# EAGLE design farduino_pico (EAGLE 7.7.0)
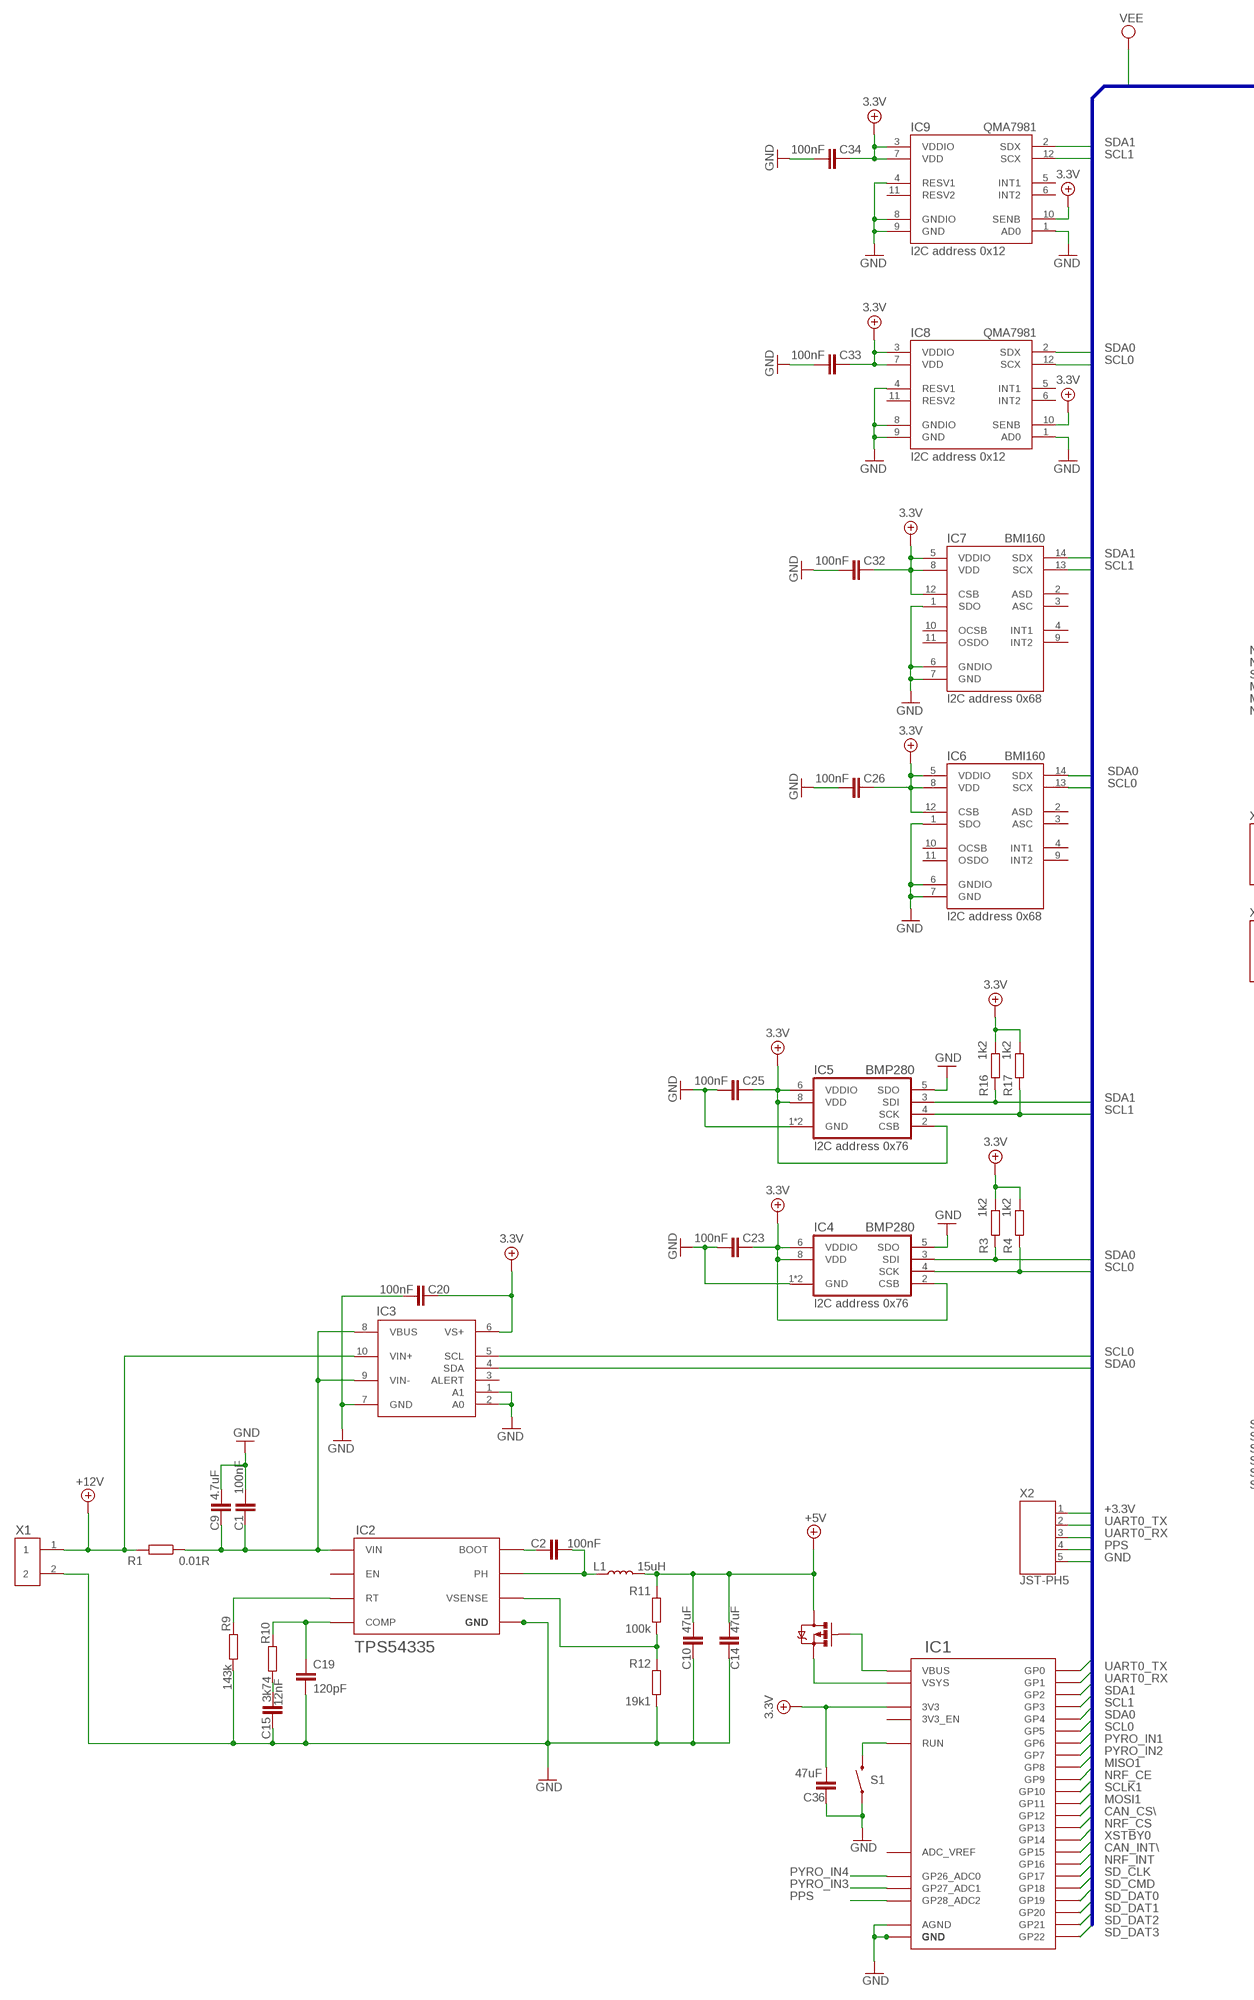
[diagram p0: schematic, sheet 1, part 1 of 2]
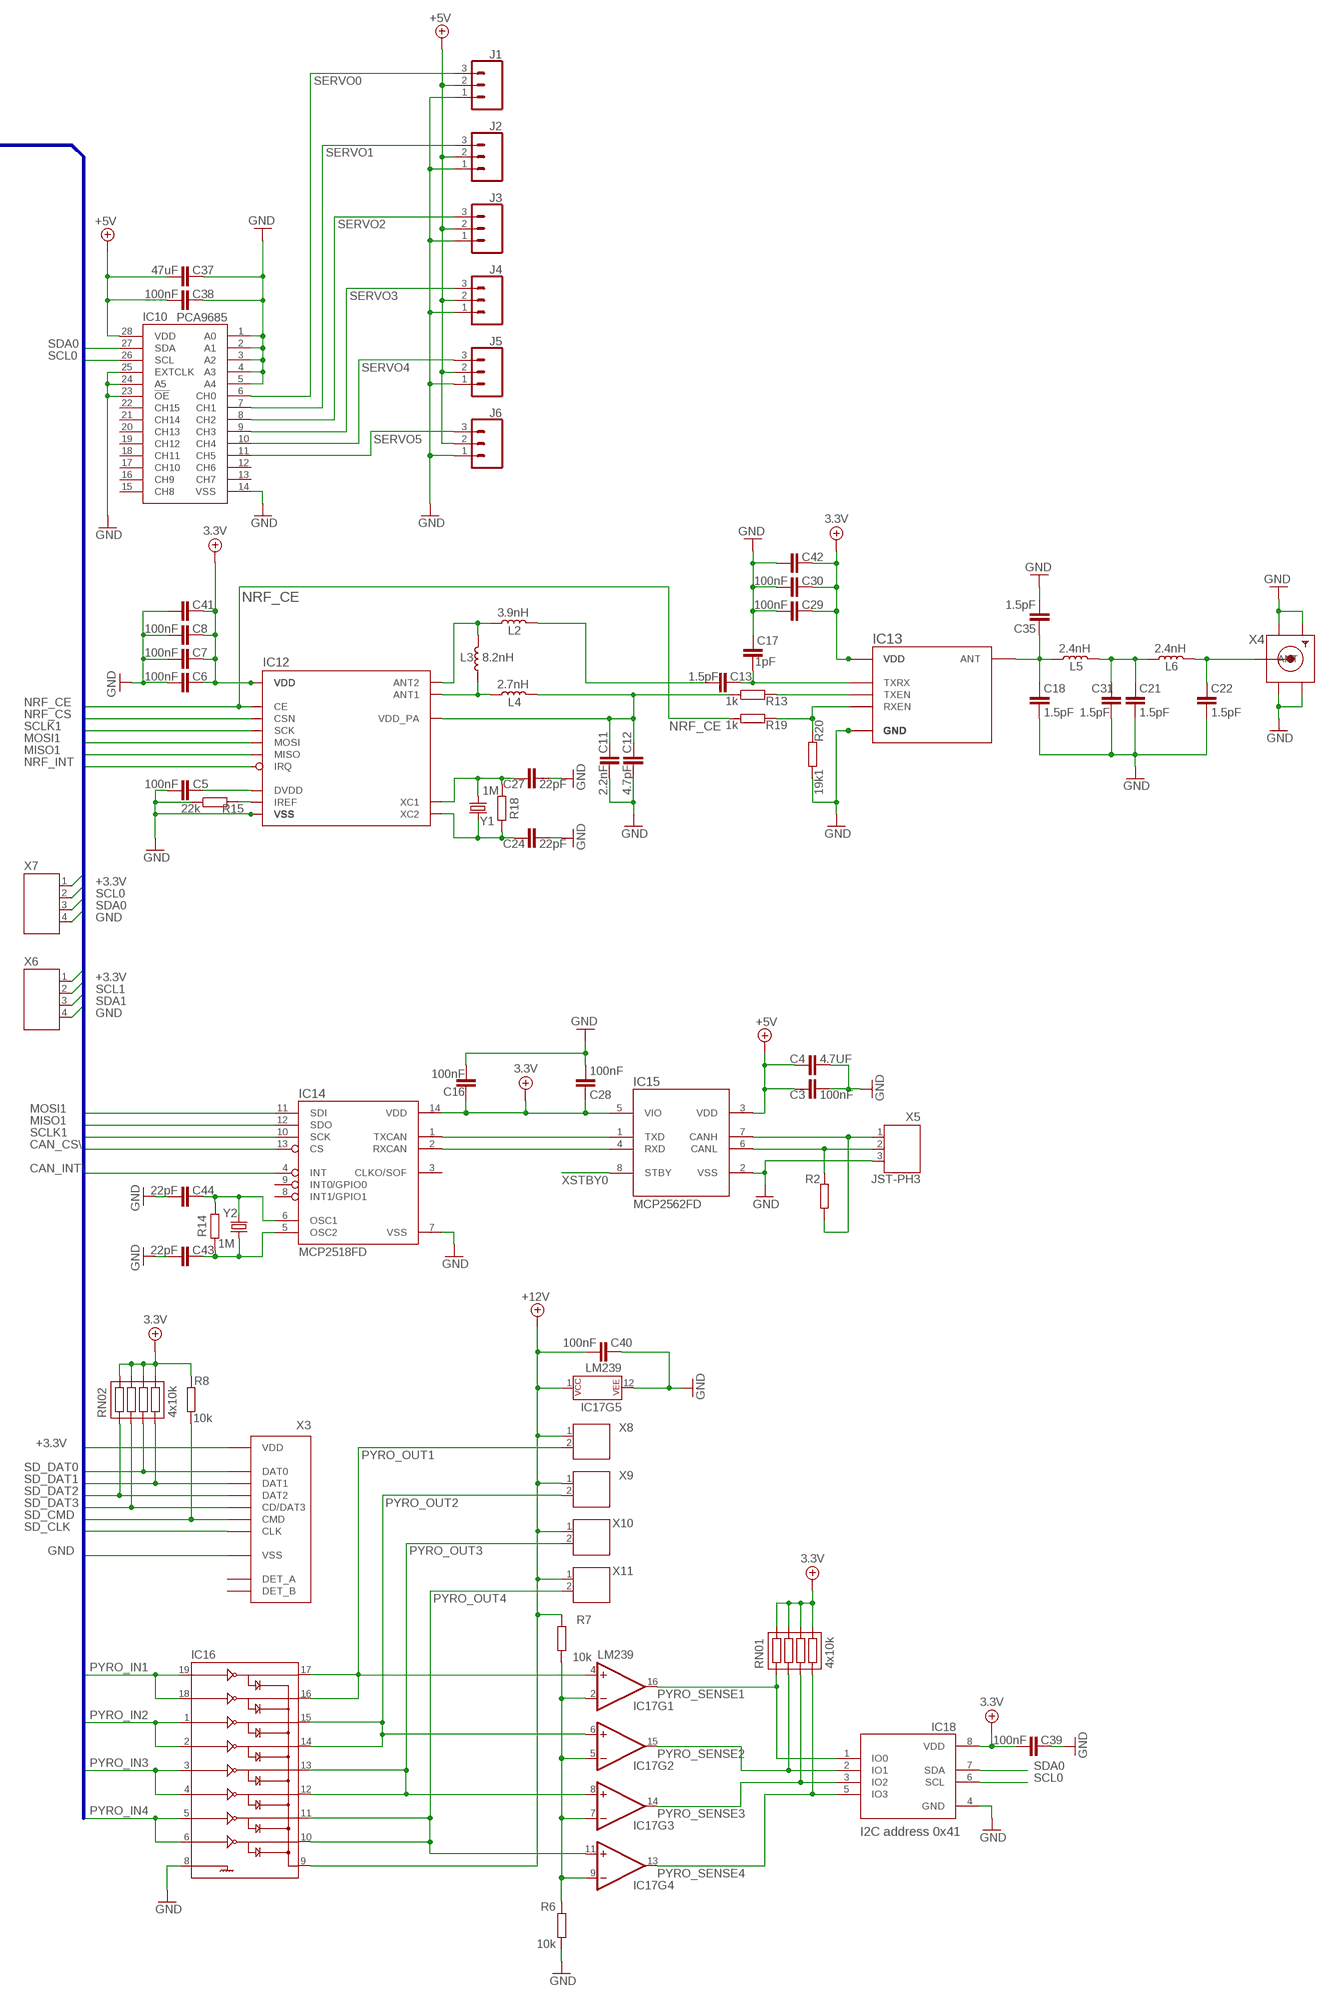
[diagram p1: schematic, sheet 1, part 2 of 2]

## Parts
C1  100nF  0.1UF-0402-16V-10%  [0402]
C2  100nF  0.1UF-0402-16V-10%  [0402]
C3  100nF  0.1UF-0402-16V-10%  [0402]
C4  4.7UF  [0402]
C5  100nF  0.1UF-0402-16V-10%  [0402]
C6  100nF  0.1UF-0402-16V-10%  [0402]
C7  100nF  0.1UF-0402-16V-10%  [0402]
C8  100nF  0.1UF-0402-16V-10%  [0402]
C9  4.7uF  4.7UF-1206-16V-(+80/-20%)  [1206]
C10  47uF  47UF-1206-10V-20%  [1206]
C11  2.2nF  C-EUC0402  [C0402]
C12  4.7pF  C-EUC0402  [C0402]
C13  1.5pF  C-EUC0402  [C0402]
C14  47uF  47UF-1206-10V-20%  [1206]
C15  12nF  C-EUC0402  [C0402]
C16  100nF  0.1UF-0402-16V-10%  [0402]
C17  1pF  C-EUC0402  [C0402]
C18  1.5pF  C-EUC0402  [C0402]
C19  120pF  C-EUC0402  [C0402]
C20  100nF  0.1UF-0402-16V-10%  [0402]
C21  1.5pF  C-EUC0402  [C0402]
C22  1.5pF  C-EUC0402  [C0402]
C23  100nF  0.1UF-0402-16V-10%  [0402]
C24  22pF  C-EUC0402  [C0402]
C25  100nF  0.1UF-0402-16V-10%  [0402]
C26  100nF  0.1UF-0402-16V-10%  [0402]
C27  22pF  C-EUC0402  [C0402]
C28  100nF  0.1UF-0402-16V-10%  [0402]
C29  100nF  0.1UF-0402-16V-10%  [0402]
C30  100nF  0.1UF-0402-16V-10%  [0402]
C31  1.5pF  C-EUC0402  [C0402]
C32  100nF  0.1UF-0402-16V-10%  [0402]
C33  100nF  0.1UF-0402-16V-10%  [0402]
C34  100nF  0.1UF-0402-16V-10%  [0402]
C35  1.5pF  C-EUC0402  [C0402]
C36  47uF  47UF-1206-10V-20%  [1206]
C37  47uF  47UF-1206-10V-20%  [1206]
C38  100nF  0.1UF-0402-16V-10%  [0402]
C39  100nF  0.1UF-0402-16V-10%  [0402]
C40  100nF  0.1UF-0402-16V-10%  [0402]
C41  4.7UF  [0402]
C42  4.7UF  [0402]
C43  22pF  C-EUC0402  [C0402]
C44  22pF  C-EUC0402  [C0402]
IC1  RPI_PICO-SMD  [RPI_PICO]
IC2  TPS54335ADRCR  [VSON-10]
IC3  INA226  [VSSOP-10]
IC4  BMP280  [BMP280]
IC5  BMP280  [BMP280]
IC6  BMI160  [BMI160]
IC7  BMI160  [BMI160]
IC8  QMA7981  [LGA-12-2X2]
IC9  QMA7981  [LGA-12-2X2]
IC10  PCA9685  [TSSOP-28_4MM]
IC12  NRF24L01SMD  [QFN20-4X4MM]
IC13  RFX2401C  [QFN-16-3X3MM]
IC14  MCP2518FD  [SO14]
IC15  MCP2562FD  MCP2562  [SO08]
IC16  ULN2803QFN  [QFN-20-4X4]
IC17  LM239  LM339QT  [QFN16]
IC18  PCA9536  [HVSON8]
J1  CONN_03  [1X03]
J2  CONN_03  [1X03]
J3  CONN_03  [1X03]
J4  CONN_03  [1X03]
J5  CONN_03  [1X03]
J6  CONN_03  [1X03]
L1  15uH  INDUCTOR-YSPIA0850-15UH  [YSPIA0850]
L2  3.9nH  INDUCTOR-0402-3.9NH  [0402]
L3  8.2nH  INDUCTOR-0402-3.9NH  [0402]
L4  2.7nH  INDUCTOR-0402-3.9NH  [0402]
L5  2.4nH  INDUCTOR-0402-3.9NH  [0402]
L6  2.4nH  INDUCTOR-0402-3.9NH  [0402]
Q1  DMG2305UX  MOSFET-PCHANNEL  [SOT23-3@1]
R1  0.01R  R-EU_R1206  [R1206]
R2  120  R-EU_R0402  [R0402]
R3  1k2  R-EU_R0402  [R0402]
R4  1k2  R-EU_R0402  [R0402]
R6  10k  R-EU_R0402  [R0402]
R7  10k  R-EU_R0402  [R0402]
R8  10k  R-EU_R0402  [R0402]
R9  143k  R-EU_R0402  [R0402]
R10  3k74  R-EU_R0402  [R0402]
R11  100k  R-EU_R0402  [R0402]
R12  19k1  R-EU_R0402  [R0402]
R13  1k  R-EU_R0402  [R0402]
R14  1M  R-EU_R0402  [R0402]
R15  22k  R-EU_R0402  [R0402]
R16  1k2  R-EU_R0402  [R0402]
R17  1k2  R-EU_R0402  [R0402]
R18  1M  R-EU_R0402  [R0402]
R19  1k  R-EU_R0402  [R0402]
R20  19k1  R-EU_R0402  [R0402]
RN01  4x10k  RN_EU  [4D02]
RN02  4x10k  RN_EU  [4D02]
S1  MOMENTARY-SWITCH-SPST  [TACTILE_SWITCH_SMD_4.2X3.2MM]
X1  XT_CONN  [XT30_PCB]
X2  JST-PH5  [JST-PH5]
X3  5033981892  [5033981892]
X4  SMACONNECTOR  [SMA90_DIP]
X5  JST-PH3  [JST-PH3]
X6  JST-PH4  [JST-PH4]
X7  JST-PH4  [JST-PH4]
X8  JST-PH2  [JST-PH2]
X9  JST-PH2  [JST-PH2]
X10  JST-PH2  [JST-PH2]
X11  JST-PH2  [JST-PH2]
Y1  CRYSTAL-16MHZ  [SMD3225]
Y2  CRYSTAL-16MHZ  [SMD3225]

## Nets
+3.3V: C6.1 C7.1 C8.1 C16.1 C20.2 C23.1 C25.1 C26.1 C28.1 C29.1 C30.1 C32.1 C33.1 C34.1 C36.2 C39.2 C41.2 C42.2 IC1.3V3 IC3.6(VS+) IC4.2(CSB) IC4.6(VDDIO) IC4.8(VDD) IC5.2(CSB) IC5.6(VDDIO) IC5.8(VDD) IC6.5(VDDIO) IC6.8(VDD) IC6.12(CSB) IC7.5(VDDIO) IC7.8(VDD) IC7.12(CSB) IC8.3(VDDIO) IC8.7(VDD) IC8.10(SENB) IC9.3(VDDIO) IC9.7(VDD) IC9.10(SENB) IC12.7(VDD) IC12.15(VDD) IC12.18(VDD) IC13.14(VDD) IC13.16(VDD) IC14.14(VDD) IC15.5(VIO) IC18.8(VDD) R3.2 R4.2 R8.2 R16.2 R17.2 RN01.5 RN01.6 RN01.7 RN01.8 RN02.5 RN02.6 RN02.7 RN02.8 X2.1 X3.4(VDD) X6.1 X7.1 ; supply symbol labelled 3.3V
+5V: C3.1 C4.1 C10.2 C14.2 C37.2 C38.2 IC10.28(VDD) IC15.3(VDD) J1.2 J2.2 J3.2 J4.2 J5.2 J6.2 L1.2 Q1.3(D) R11.2
+12V: C40.2 IC3.10(VIN+) IC16.9(COM) IC17.1(P$V+) R1.2 R7.2 X1.1 X8.1 X9.1 X10.1 X11.1
ANT1: IC12.12(ANT1) L3.1 L4.1
ANT2: IC12.13(ANT2) L2.1 L3.2
CAN1_H: IC15.7(CANH) R2.1 X5.1
CAN1_L: IC15.6(CANL) R2.2 X5.2
CAN_CS\: IC1.GP12 IC14.13(CS)
CAN_INT\: IC1.GP15 IC14.4(INT)
DCDC_BOOT: C2.2 IC2.9(BOOT)
DCDC_COMP: C19.1 IC2.7(COMP) R10.1
DCDC_PH: C2.1 IC2.2(PH) L1.1
DCDC_RT: IC2.10(RT) R9.1
DVDD: C5.1 IC12.19(DVDD)
FILTER1: C21.1 C31.1 L5.2 L6.1
GND: C1.1 C3.2 C4.2 C5.2 C6.2 C7.2 C8.2 C9.2 C10.1 C11.2 C12.2 C14.1 C15.2 C16.2 C17.1 C18.2 C19.2 C20.1 C21.2 C22.2 C23.2 C24.2 C25.2 C26.2 C27.2 C28.2 C29.2 C30.2 C31.2 C32.2 C33.2 C34.2 C35.2 C36.1 C37.1 C38.1 C39.1 C40.1 C41.1 C42.1 C43.2 C44.2 IC1.AGND IC1.GND@1(GND) IC1.GND@2(GND) IC1.GND@3(GND) IC1.GND@4(GND) IC1.GND@5(GND) IC1.GND@6(GND) IC1.GND@7(GND) IC1.GND@8(GND) IC2.3(GND) IC2.4(GND) IC2.5(GND) IC2.11(GND) IC3.1(A1) IC3.2(A0) IC3.7(GND) IC4.1(GND) IC4.5(SDO) IC4.7(GND) IC5.1(GND) IC5.5(SDO) IC5.7(GND) IC6.1(SDO) IC6.6(GNDIO) IC6.7(GND) IC7.1(SDO) IC7.6(GNDIO) IC7.7(GND) IC8.1(AD0) IC8.4(RESV1) IC8.8(GNDIO) IC8.9(GND) IC9.1(AD0) IC9.4(RESV1) IC9.8(GNDIO) IC9.9(GND) IC10.1(A0) IC10.2(A1) IC10.3(A2) IC10.4(A3) IC10.5(A4) IC10.14(VSS) IC10.23(!OE) IC10.24(A5) IC10.25(EXTCLK) IC12.0(VSS) IC12.8(VSS) IC12.14(VSS) IC12.17(VSS) IC12.20(VSS) IC13.1(GND) IC13.2(GND) IC13.3(GND) IC13.7(GND) IC13.8(GND) IC13.9(GND) IC13.11(GND) IC13.12(GND) IC13.15(GND) IC13.17(GND) IC14.7(VSS) IC15.2(VSS) IC16.8(GND) IC17.12(P$V-) IC18.4(GND) J1.1 J2.1 J3.1 J4.1 J5.1 J6.1 R6.1 R9.2 R12.1 R15.1 R20.1 S1.1 S1.2 X1.2 X2.5 X3.6(VSS) X4.GND1 X4.GND2 X4.GND3 X4.GND4 X5.3 X6.4 X7.4
IREF: IC12.16(IREF) R15.2
MISO1: IC1.GP8 IC12.5(MISO) IC14.12(SDO)
MOSI1: IC1.GP11 IC12.4(MOSI) IC14.11(SDI)
N$6: C15.1 R10.2
NRF_CE: IC1.GP9 IC12.1(CE) R19.1
NRF_CS: IC1.GP13 IC12.2(CSN)
NRF_INT: IC1.GP16 IC12.6(IRQ)
NRF_SIGNAL: C13.2 L2.2
OSC1_40MHZ: C44.1 IC14.6(OSC1) R14.2 Y2.3
OSC2_40MHZ: C43.1 IC14.5(OSC2) R14.1 Y2.1
PA_ANT: C18.1 C35.1 IC13.10(ANT) L5.1
PPS: IC1.GP28_A2(GP28_ADC2) X2.4
PYRO_IN1: IC1.GP6 IC16.18(IN2) IC16.19(IN1)
PYRO_IN2: IC1.GP7 IC16.1(IN3) IC16.2(IN4)
PYRO_IN3: IC1.GP27_A1(GP27_ADC1) IC16.3(IN5) IC16.4(IN6)
PYRO_IN4: IC1.GP26_A0(GP26_ADC0) IC16.5(IN7) IC16.6(IN8)
PYRO_OUT1: IC16.16(OUT2) IC16.17(OUT1) IC17.4(+IN) X8.2
PYRO_OUT2: IC16.14(OUT4) IC16.15(OUT3) IC17.6(+IN) X9.2
PYRO_OUT3: IC16.12(OUT6) IC16.13(OUT5) IC17.8(+IN) X10.2
PYRO_OUT4: IC16.10(OUT8) IC16.11(OUT7) IC17.11(+IN) X11.2
PYRO_SENSE1: IC17.16(OUT) IC18.1(IO0) RN01.1
PYRO_SENSE2: IC17.15(OUT) IC18.2(IO1) RN01.2
PYRO_SENSE3: IC17.14(OUT) IC18.3(IO2) RN01.3
PYRO_SENSE4: IC17.13(OUT) IC18.5(IO3) RN01.4
RUN: IC1.RUN S1.3 S1.4
RXCAN1: IC14.2(RXCAN) IC15.4(RXD)
RXEN: IC13.6(RXEN) R19.2 R20.2
SCL0: IC1.GP5 IC3.5(SCL) IC4.4(SCK) IC6.13(SCX) IC8.12(SCX) IC10.26(SCL) IC18.6(SCL) R4.1 X7.2
SCL1: IC1.GP3 IC5.4(SCK) IC7.13(SCX) IC9.12(SCX) R17.1 X6.2
SCLK1: IC1.GP10 IC12.3(SCK) IC14.10(SCK)
SD_CLK: IC1.GP17 X3.5(CLK)
SD_CMD: IC1.GP18 R8.1 X3.3(CMD)
SD_DAT0: IC1.GP19 RN02.3 X3.7(DAT0)
SD_DAT1: IC1.GP20 RN02.4 X3.8(DAT1)
SD_DAT2: IC1.GP21 RN02.1 X3.1(DAT2)
SD_DAT3: IC1.GP22 RN02.2 X3.2(CD/DAT3)
SDA0: IC1.GP4 IC3.4(SDA) IC4.3(SDI) IC6.14(SDX) IC8.2(SDX) IC10.27(SDA) IC18.7(SDA) R3.1 X7.3
SDA1: IC1.GP2 IC5.3(SDI) IC7.14(SDX) IC9.2(SDX) R16.1 X6.3
SERVO0: IC10.6(CH0) J1.3
SERVO1: IC10.7(CH1) J2.3
SERVO2: IC10.8(CH2) J3.3
SERVO3: IC10.9(CH3) J4.3
SERVO4: IC10.10(CH4) J5.3
SERVO5: IC10.11(CH5) J6.3
SMA_RF: C22.1 L6.2 X4.ANTENNA(ANT)
TXCAN1: IC14.1(TXCAN) IC15.1(TXD)
TXEN: IC13.5(TXEN) R13.2
TXRX: C13.1 C17.2 IC13.4(TXRX)
UART0_RX: IC1.GP1 X2.3
UART0_TX: IC1.GP0 X2.2
UREF: IC17.2(-IN) IC17.5(-IN) IC17.7(-IN) IC17.9(-IN) R6.2 R7.1
VBUS: IC1.VBUS Q1.1(G)
VDD_PA: C11.1 C12.1 IC12.11(VDD_PA) L4.2 R13.1
VIN: C1.2 C9.1 IC2.1(VIN) IC3.8(VBUS) IC3.9(VIN-) R1.1
VSENSE: IC2.6(VSENSE) R11.1 R12.2
VSYS: IC1.VSYS Q1.2(S)
XC1_16MHZ: C27.1 IC12.10(XC1) R18.1 Y1.1
XC2_16MHZ: C24.1 IC12.9(XC2) R18.2 Y1.3
XSTBY0: IC1.GP14 IC15.8(STBY)
Unconnected: IC1.3V3_EN IC1.ADC_VREF IC2.8(EN) IC3.3(ALERT) IC6.2(ASD) IC6.3(ASC) IC6.4(INT1) IC6.9(INT2) IC6.10(OCSB) IC6.11(OSDO) IC7.2(ASD) IC7.3(ASC) IC7.4(INT1) IC7.9(INT2) IC7.10(OCSB) IC7.11(OSDO) IC8.5(INT1) IC8.6(INT2) IC8.11(RESV2) IC9.5(INT1) IC9.6(INT2) IC9.11(RESV2) IC10.12(CH6) IC10.13(CH7) IC10.15(CH8) IC10.16(CH9) IC10.17(CH10) IC10.18(CH11) IC10.19(CH12) IC10.20(CH13) IC10.21(CH14) IC10.22(CH15) IC14.3(CLKO/SOF) IC14.8(INT1/GPIO1) IC14.9(INT0/GPIO0) X3.DLMA(DET_A) X3.DSMA(DET_B)

## Buses
GP[0..28],CAN_CS\,CAN_INT\,XSTDBY0,PYRO_IN[1..4],PYRO_EN,MISO[0..1],MOSI[0..1],SCLK[0..1],SDA[0..1],SCL[0..1],SD_CMD,SD_CLK,SD_DAT[0..3],ADC[0..2],UART0_RX,UART0_TX,PPS,NRF_CE,NRF_CS,NRF_INT,+3.3V,+5V,GND,VIN

## Notes on the sheet
- I2C address 0x12
- I2C address 0x12
- I2C address 0x68
- I2C address 0x68
- I2C address 0x76
- I2C address 0x76
- I2C address 0x41

## Library data of the parts
C1-C3 C5-C8 C16 C20 C23 C25 C26 C28-C30 C32-C34 C38-C40 = SparkFun-Capacitors:0.1UF: 100nF ceramic capacitors A capacitor is a passive two-terminal electrical component used to store electrical energy temporarily in an electric field.; LCSC_PART: C338032; PROD_ID: CAP-12416
C4 C41 C42 = SparkFun-Capacitors:4.7UF: 4.7µF ceramic capacitors A capacitor is a passive two-terminal electrical component used to store electrical energy temporarily in an electric field.
C9 = SparkFun-Capacitors:4.7UF: 4.7µF ceramic capacitors A capacitor is a passive two-terminal electrical component used to store electrical energy temporarily in an electric field.; LCSC_PART: C132148; PROD_ID: CAP-10300
C10 C14 C36 C37 = SparkFun-Capacitors:47UF; LCSC_PART: C94034
C11-C13 C15 C17-C19 C21 C22 C24 C27 C31 C35 C43 C44 = rcl_updated:C-EU: CAPACITOR, European symbol
IC1 = RaspberryPi_Pico:RPI_PICO
IC2 = texas_2:TPS54335ADRCR; LCSC_PART: C473400
IC3 = FaBo-Sensor:INA226; LCSC_PART: C49851
IC4 IC5 = bosch-bmp280:BMP280: The BMP280 is an absolute barometric pressure sensor especially designed for mobile applications. The sensor module is housed in an extremely compact 8-pin metal-lid LGA package with a footprint of only 2.0 × 2.5 mm2 and 0.95 mm package height. Its small dimensions and its low power consumption of 2.7 μA @1Hz allow the implementation in battery driven devices such as mobile phones, GPS modules or watches. The library has been designed by Richard Magdycz <https://www.facebook.com/groups/eaglecadsoftUK>
IC6 IC7 = FaBo-Mems:BMI160
IC8 IC9 = SparkFun-IC-Special-Function:QMA7981
IC10 = SparkFun-IC-Special-Function:PCA9685: 16-channel 12-bit PWM I2C interface Internal Oscillator 40Hz to 1kHz Can be totem pole or open collector 2.3V to 5.5V SparkFun Products SparkFun Block for Intel® Edison - PWM <https://www.sparkfun.com/products/13042> (DEV-13042) PROTO: IC-12240 PROD_ID: IC-12271; PROD_ID: IC-12271
IC12 = SparkFun-RF:NRF24L01: Nordic nrf24L01 2.4GHz Low-power Transceiver This is the very popular, low cost, very low power RF transceiver from Nordic Semiconductor. Simple SPI interface. SparkFun Products 2.4GHz Transceiver IC - nRF24L01+ <https://www.sparkfun.com/products/690> (COM-00690) SparkFun Transceiver Breakout - nRF24L01+ (RP-SMA) <https://www.sparkfun.com/products/705> (WRL-00705) SparkFun Transceiver Breakout - nRF24L01+ <https://www.sparkfun.com/products/691> (COM-00691); PROD_ID: IC-08950; SF_ID: COM-00690
IC13 = SparkFun-RF:RFX2401C
IC14 = SparkFun-IC-Comms:MCP2518FD; LCSC_PART: C626759
IC15 = SparkFun-IC-Comms:MCP2562; LCSC_PART: C124016
IC16 = SparkFun-IC-Special-Function:ULN2803: Darlington Driver(IC-07959, low stock) ULN2803 Darlington array. 500mA max per channel, 8-channel package. Spark Fun Electronics SKU : COM-00312
IC17 = SparkFun-IC-Amplifiers:LM339: Quad Comparator - LM339PWR Based on information from the SLCS006N datasheet from TI (www.ti.com). Created by nick@scantool.net, 2008. Updated 2016. SparkFun Products SparkFun OBD-II UART <https://www.sparkfun.com/products/9555> (WIG-09555) SparkFun Car Diagnostics Kit <https://www.sparkfun.com/products/10769> (RTL-10769)
IC18 = SparkFun-IC-Special-Function:PCA9536
J1-J6 = SparkFun-Connectors:CONN_03: Multi connection point. Often used as Generic Header-pin footprint for 0.1 inch spaced/style header connections On any of the 0.1 inch spaced packages, you can populate with these: Break Away Headers - Straight <https://www.sparkfun.com/products/116> (PRT-00116) Break Away Male Headers - Right Angle <https://www.sparkfun.com/products/553> (PRT-00553) Female Headers <https://www.sparkfun.com/products/115> (PRT-00115) Break Away Headers - Machine Pin <https://www.sparkfun.com/products/117> (PRT-00117) Break Away Female Headers - Swiss Machine Pin <https://www.sparkfun.com/products/743> (PRT-00743) Stackable Header - 3 Pin (Female, 0.1") <https://www.sparkfun.com/products/13875> (PRT-13875) For SCREWTERMINALS and SPRING TERMINALS visit here: Screw Terimnals on SparkFun.com <https://www.sparkfun.com/search/results?term=Screw+Terminals> (5mm/3.5mm/2.54mm spacing) This device is also useful as a general connection point to wire up your design to another part of your project. Our various solder wires solder well into these plated through hole pads. Hook-Up Wire - Assortment (Stranded, 22 AWG) <https://www.sparkfun.com/products/11375> (PRT-11375) Hook-Up Wire - Assortment (Solid Core, 22 AWG) <https://www.sparkfun.com/products/11367> (PRT-11367) View the entire wire category on our website here <https://www.sparkfun.com/categories/141> Special notes: Molex polarized connector foot print use with SKU : PRT-08232 with associated crimp pins and housings.
L1 = SparkFun-Coils:INDUCTOR: Inductors Resist changes in electrical current. Basically a coil of wire. SparkFun Products: SparkFun Load Cell Amplifier - HX711 <https://www.sparkfun.com/products/13879> IOIO-OTG - V2.2 <https://www.sparkfun.com/products/13613>; LCSC_PART: C2839929
L2-L6 = SparkFun-Coils:INDUCTOR: Inductors Resist changes in electrical current. Basically a coil of wire. SparkFun Products: SparkFun Load Cell Amplifier - HX711 <https://www.sparkfun.com/products/13879> IOIO-OTG - V2.2 <https://www.sparkfun.com/products/13613>; PROD_ID: NDUC-13457; VALUE: 3.9NH
Q1 = SparkFun-DiscreteSemi:MOSFET-PCHANNEL: Generic PMOSFET IRLML2244 - TRANS-11153 (SOT-23 -20V -4.3A) (1.Gate 2.Source 3.Drain) FQP27P06 - COM-10349 <http://www.sparkfun.com/products/10349> (TO-220 -60V -27A) (1.Gate 2.Source 3.Drain); PROD_ID: TRANS-08285
R1-R4 R6-R20 = rcl_updated:R-EU_: RESISTOR, European symbol
RN01 RN02 = rcl_updated:RN_EU
S1 = SparkFun-Switches:MOMENTARY-SWITCH-SPST: Momentary Switch (Pushbutton) - SPST Normally-open (NO) SPST momentary switches (buttons, pushbuttons). Variants PTH-12MM - 12mm square, through-hole Momentary Pushbutton Switch - 12mm Square <https://www.sparkfun.com/products/9190> (COM-09190) PTH-6.0MM, PTH-6.0MM-KIT - 6.0mm square, through-hole Mini Pushbutton Switch <https://www.sparkfun.com/products/97> (COM-00097) KIT package intended for soldering kit's - only one side of pads' copper is exposed. PTH-RIGHT-ANGLE-KIT - Right-angle, through-hole Right Angle Tactile Button <https://www.sparkfun.com/products/10791> - Used on SparkFun BigTime Watch Kit <https://www.sparkfun.com/products/11734> SMD-12MM - 12mm square, surface-mount Tactile Button - SMD (12mm) <https://www.sparkfun.com/products/12993> (COM-12993) Used on SparkFun PicoBoard <https://www.sparkfun.com/products/11888> SMD-4.5MM - 4.5mm Square Trackball Switch Used on SparkFun Blackberry Trackballer Breakout <https://www.sparkfun.com/products/13169> SMD-4.6MMX2.8MM - 4.60mm x 2.80mm, surface mount Used on SparkFun SAMD21 Mini Breakout <https://www.sparkfun.com/products/13664> SMD-5.2MM, SMD-5.2-REDUNDANT - 5.2mm square, surface-mount Mini Pushbutton Switch - SMD <https://www.sparkfun.com/products/8720> (COM-08720) Used on Arduino Pro Mini <https://www.sparkfun.com/products/11114> REDUNDANT package connects both switch circuits together SMD-6.0X3.5MM - 6.0 x 3.5mm, surface mount Momentary Reset Switch SMD <https://www.sparkfun.com/products/8229> (COM-08229) SMD-6.2MM-TALL - 6.2mm square, surface mount Tactile Button - SMD (6mm) <https://www.sparkfun.com/products/12992> Used on SparkFun Digital Sandbox <https://www.sparkfun.com/products/12651> SMD-RIGHT-ANGLE - Right-angle, surface mount Used on SparkFun Block for Intel® Edison - Arduino <https://www.sparkfun.com/products/13036>
X1 = SparkFun-Connectors:XT_CONN
X2 = jst-ph:JST-PH5
X3 = Molex_MicroSD:5033981892
X4 = adafruit:SMACONNECTOR: SMA Connector 90° DIP SMA Connector, 50 Ohm (4UConnector: 07259)
X5 = jst-ph:JST-PH3
X6 X7 = jst-ph:JST-PH4; LCSC_PART: C265289
X8-X11 = jst-ph:JST-PH2
Y1 Y2 = SparkFun-Clocks:CRYSTAL-16MHZ: 16MHz Crystal Digikey Example <http://www.digikey.com/product-search/en?keywords=535-9122-1-ND> Frequency: 16MHz Frequency Stability: ±50ppm Frequency Tolerance: ±20ppm Load Capacitance: 18pF SparkFun Products: Pro Micro -5V/16MHz <https://www.sparkfun.com/products/12640> SparkFun Serial Enabled LCD Kit <https://www.sparkfun.com/products/10097>

## Board
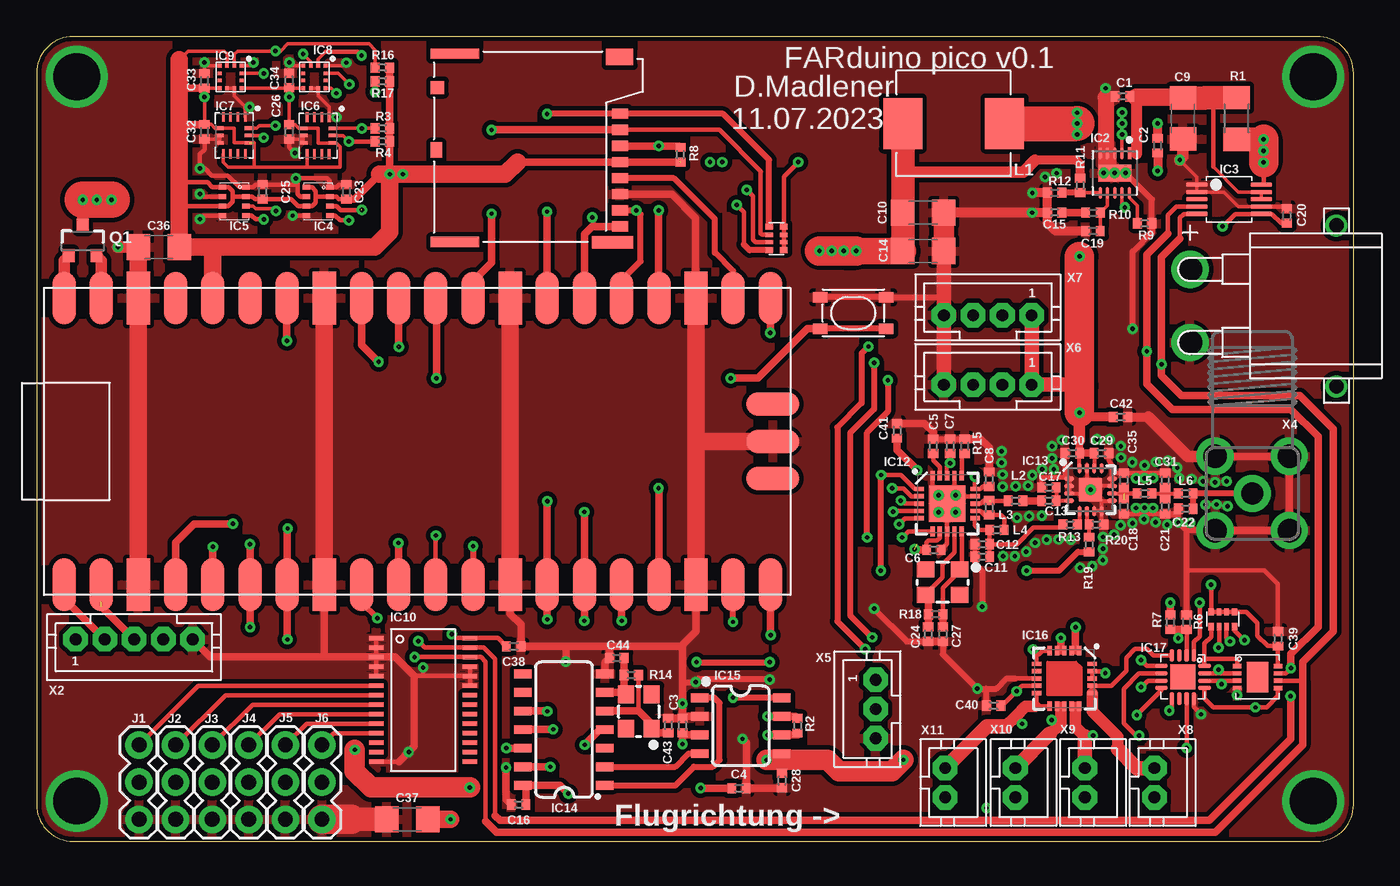
[diagram p2: board, top side]
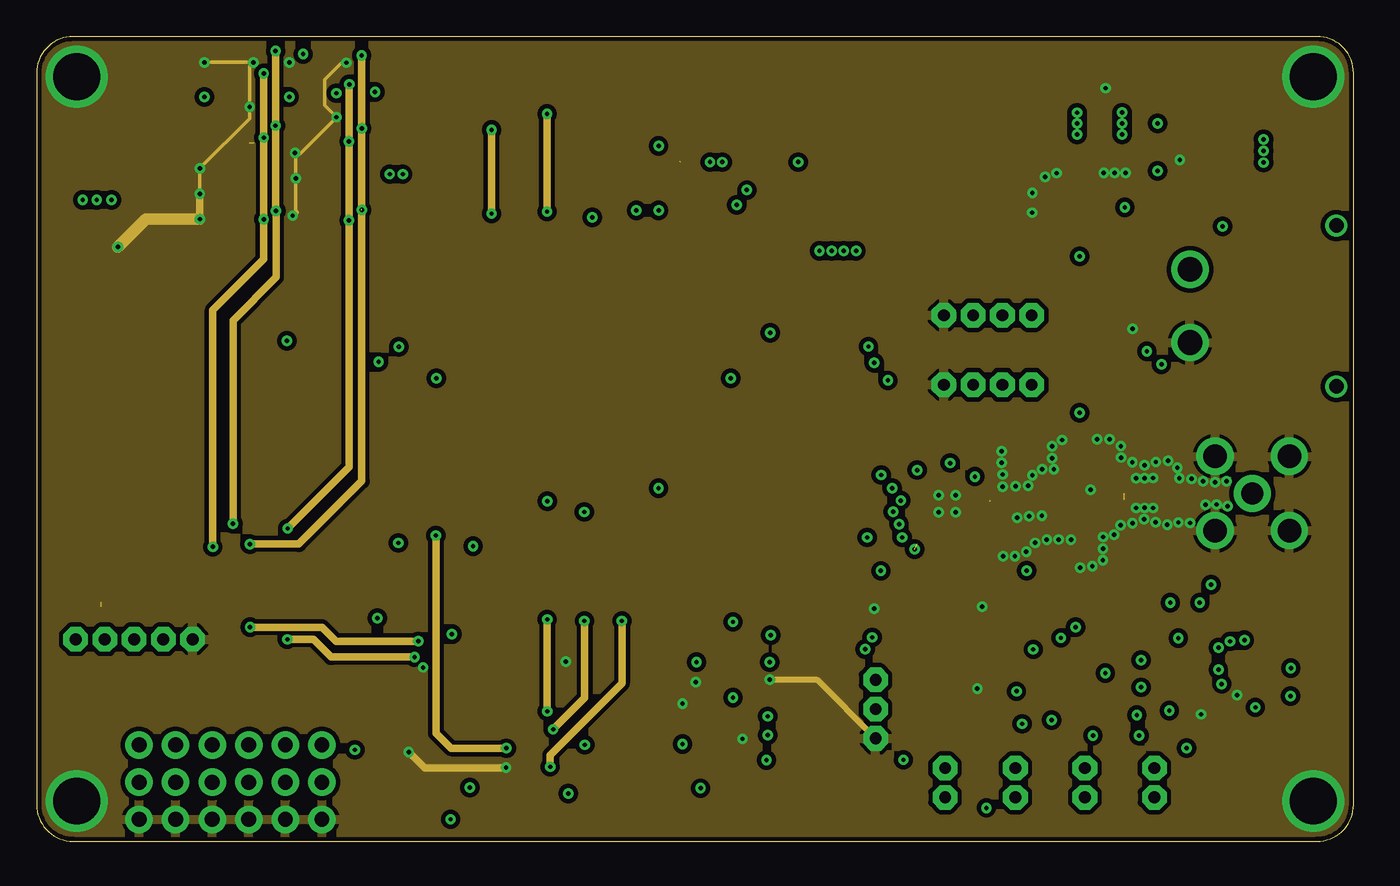
[diagram p3: board, inner layer Route2]
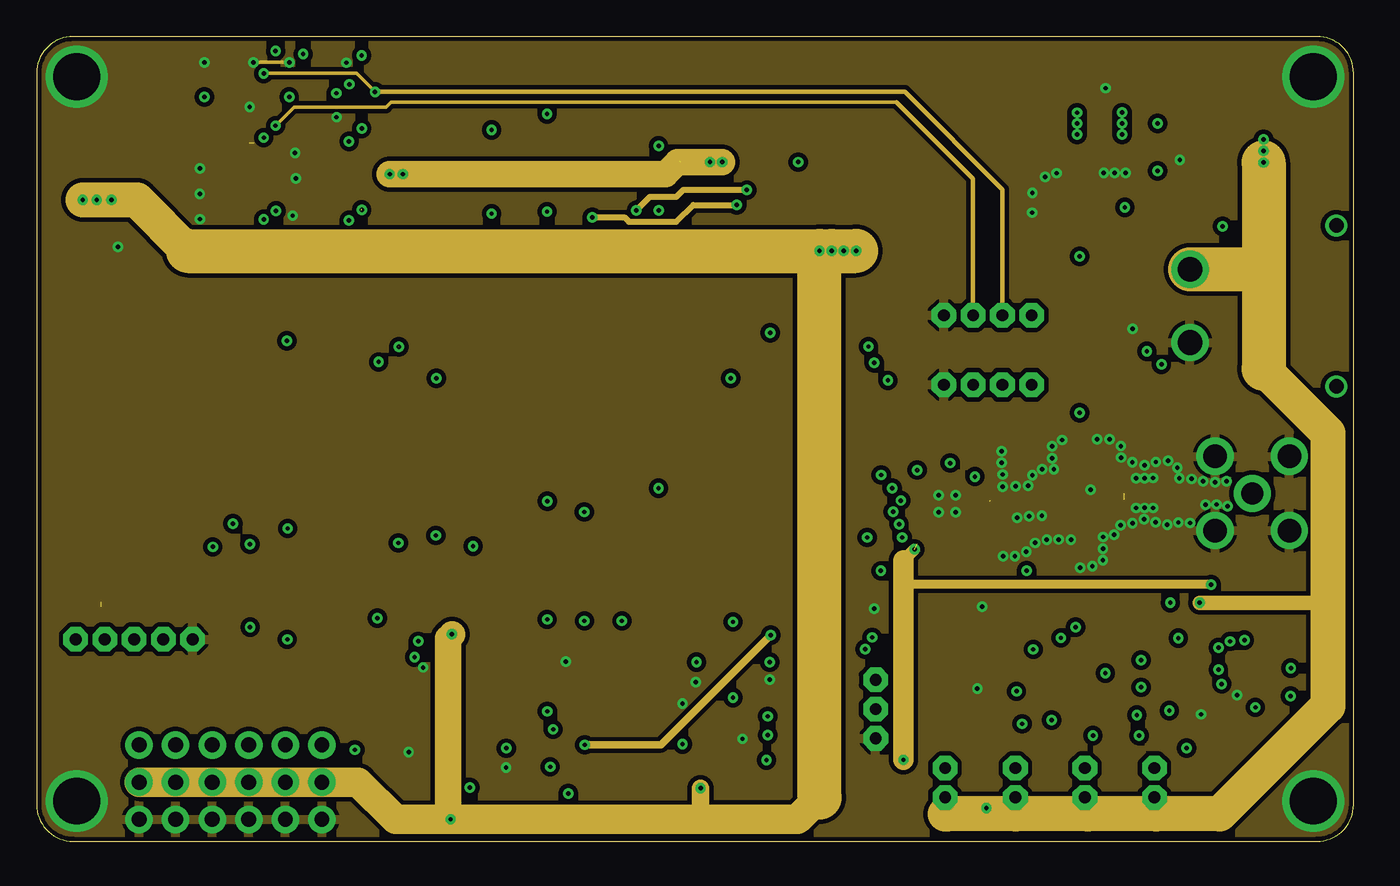
[diagram p4: board, inner layer Route15]
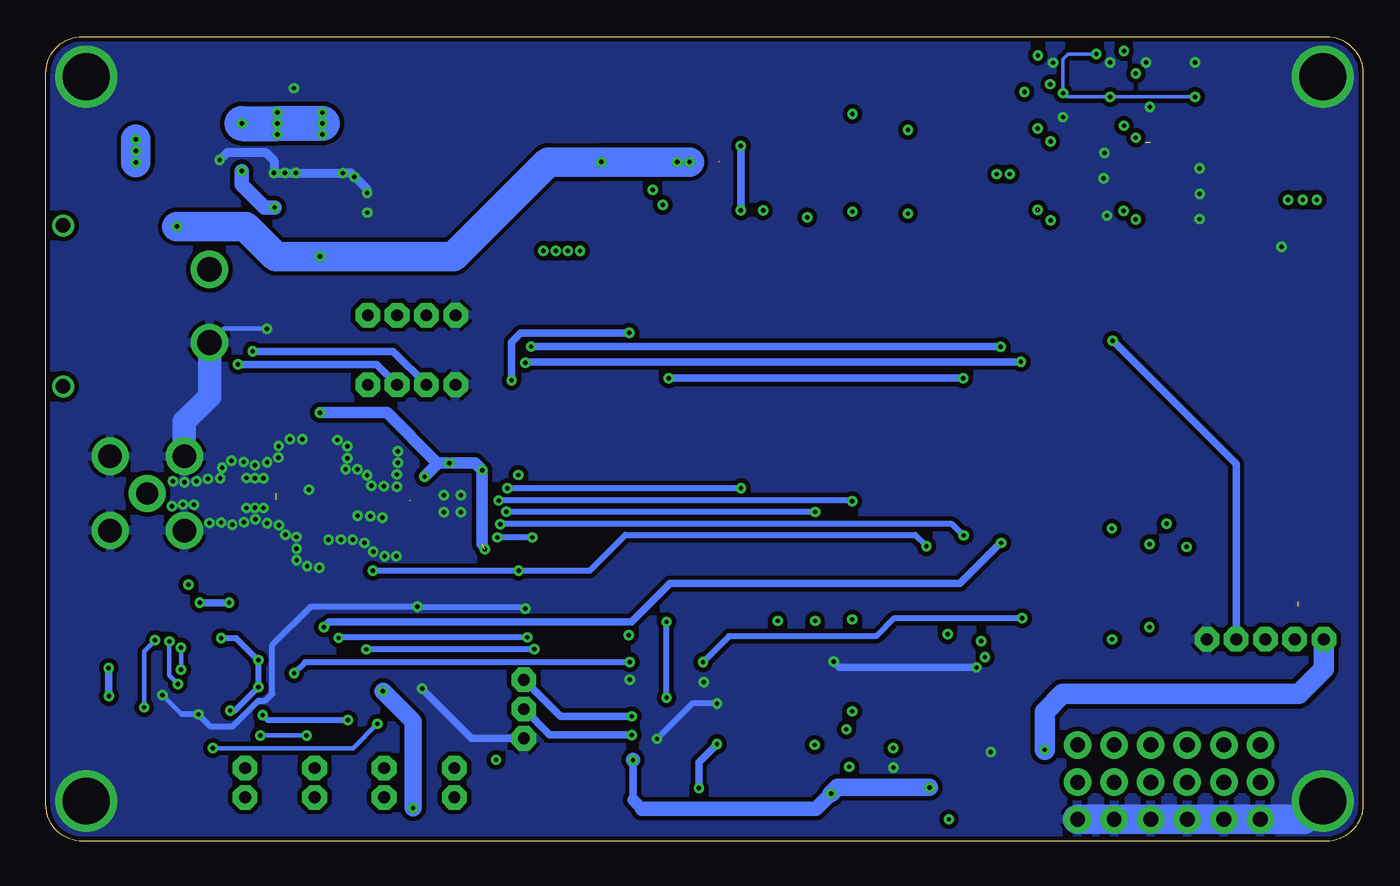
[diagram p5: board, bottom side, seen from below]

Size 90 x 55 mm. Coordinates in mm from the lower left corner, seen from the top.
Outline: 0,52.5 0,2.5 arc90 2.5,0 87.5,0 arc90 90,2.5 90,52.5 arc90 87.5,55 2.5,55 arc90 0,52.5
Copper layers (1+2+15+16): Top 0.035mm / dielectric 1.5mm / Route2 0.035mm / dielectric 0.15mm / Route15 0.035mm / dielectric 0.2mm / Bottom 0.035mm
Design rules "default *": minimum track width 5mil, minimum drill 0.3mm, track to track 5mil, track to pad 5mil, pad to pad 5mil, via to via 8mil, smd to smd 5mil, copper to edge 0.3mm, drill to drill 10mil, minimum pad ring 10mil, minimum via ring 8mil, stop-mask expansion 4mil, vias tented up to drill 0mil, thermal gap 10mil

### Footprints (pad centres in the part's own frame; a part is rotated, then mirrored left to right if it is on the bottom)
0402 = smd 0.6 x 0.7: 1 -0.5,0; 2 0.5,0
1206 = smd 1.6 x 1.8: 1 -1.4,0; 2 1.4,0
C0402 = smd 0.6 x 0.7: 1 -0.5,0; 2 0.5,0
RPI_PICO = smd 3.6 x 1.6: 3V3 20.3,39.47; 3V3_EN 20.3,42.01; ADC_VREF 20.3,36.93; AGND 20.3,31.85; GND@1 0.7,44.55; GND@2 0.7,31.85; GND@3 0.7,19.15; GND@4 0.7,6.45; GND@6 20.3,6.45; GND@7 20.3,19.15; GND@8 20.3,44.55; GP0 0.7,49.63; GP1 0.7,47.09; GP2 0.7,42.01; GP3 0.7,39.47; GP4 0.7,36.93; GP5 0.7,34.39; GP6 0.7,29.31; GP7 0.7,26.77; GP8 0.7,24.23; GP9 0.7,21.69; GP10 0.7,16.61; GP11 0.7,14.07; GP12 0.7,11.53; GP13 0.7,8.99; GP14 0.7,3.91; GP15 0.7,1.37; GP16 20.3,1.37; GP17 20.3,3.91; GP18 20.3,8.99; GP19 20.3,11.53; GP20 20.3,14.07; GP21 20.3,16.61; GP22 20.3,21.69; GP26_A0 20.3,26.77; GP27_A1 20.3,29.31; GP28_A2 20.3,34.39; RUN 20.3,24.23; VBUS 20.3,49.63; VSYS 20.3,47.09 | smd 1.6 x 3.6: GND@5 10.5,1.2; SWCLK 7.96,1.2; SWDIO 13.04,1.2
VSON-10 = smd 0.81 x 0.239: 1 -1.351,1; 2 -1.351,0.5; 3 -1.351,0; 4 -1.351,-0.5; 5 -1.351,-1; 6 1.351,-1; 7 1.351,-0.5; 8 1.351,0; 9 1.351,0.5; 10 1.351,1 | smd 1.16 x 2.25: 11 0,0
VSSOP-10 = smd 1.45 x 0.3: 1 -2.2,1; 2 -2.2,0.5; 3 -2.2,0; 4 -2.2,-0.5; 5 -2.2,-1; 6 2.2,-1; 7 2.2,-0.5; 8 2.2,0; 9 2.2,0.5; 10 2.2,1
BMP280 = smd 0.35 x 0.5: 1 0.975,-0.8; 2 0.325,-0.8; 3 -0.325,-0.8; 4 -0.975,-0.8; 5 -0.975,0.8; 6 -0.325,0.8; 7 0.325,0.8; 8 0.975,0.8
BMI160 = smd 0.675 x 0.25: 1 -1.262,0.75; 2 -1.262,0.25; 3 -1.262,-0.25; 4 -1.262,-0.75; 8 1.262,-0.75; 9 1.262,-0.25; 10 1.262,0.25; 11 1.262,0.75 | smd 0.25 x 0.675: 5 -0.5,-1.012; 6 0,-1.012; 7 0.5,-1.012; 12 0.5,1.012; 13 0,1.012; 14 -0.5,1.012
LGA-12-2X2 = smd 0.275 x 0.25: 1 -0.76,0.75; 2 -0.76,0.25; 3 -0.76,-0.25; 4 -0.76,-0.75; 7 0.76,-0.75; 8 0.76,-0.25; 9 0.76,0.25; 10 0.76,0.75 | smd 0.25 x 0.275: 5 -0.25,-0.76; 6 0.25,-0.76; 11 0.25,0.76; 12 -0.25,0.76
TSSOP-28_4MM = smd 1 x 0.3: 1 -3.2,4.225; 2 -3.2,3.575; 3 -3.2,2.925; 4 -3.2,2.275; 5 -3.2,1.625; 6 -3.2,0.975; 7 -3.2,0.325; 8 -3.2,-0.325; 9 -3.2,-0.975; 10 -3.2,-1.625; 11 -3.2,-2.275; 12 -3.2,-2.925; 13 -3.2,-3.575; 14 -3.2,-4.225; 15 3.2,-4.225; 16 3.2,-3.575; 17 3.2,-2.925; 18 3.2,-2.275; 19 3.2,-1.625; 20 3.2,-0.975; 21 3.2,-0.325; 22 3.2,0.325; 23 3.2,0.975; 24 3.2,1.625; 25 3.2,2.275; 26 3.2,2.925; 27 3.2,3.575; 28 3.2,4.225
QFN20-4X4MM = smd 2.5 x 2.5: 0 0,0 | smd 0.65 x 0.3: 1 -1.9,1; 2 -1.9,0.5; 3 -1.9,0; 4 -1.9,-0.5; 5 -1.9,-1; 11 1.9,-1; 12 1.9,-0.5; 13 1.9,0; 14 1.9,0.5; 15 1.9,1 | smd 0.3 x 0.65: 6 -1,-1.9; 7 -0.5,-1.9; 8 0,-1.9; 9 0.5,-1.9; 10 1,-1.9; 16 1,1.9; 17 0.5,1.9; 18 0,1.9; 19 -0.5,1.9; 20 -1,1.9
QFN-16-3X3MM = smd 0.68 x 0.28: 1 -1.46,0.75; 2 -1.46,0.25; 3 -1.46,-0.25; 4 -1.46,-0.75; 9 1.46,-0.75; 10 1.46,-0.25; 11 1.46,0.25; 12 1.46,0.75 | smd 0.28 x 0.68: 5 -0.75,-1.46; 6 -0.25,-1.46; 7 0.25,-1.46; 8 0.75,-1.46; 13 0.75,1.46; 14 0.25,1.46; 15 -0.25,1.46; 16 -0.75,1.46 | smd 1.6 x 1.6: 17 0,0
SO14 = smd 0.6 x 1.2: 1 -3.81,-2.8; 2 -2.54,-2.8; 3 -1.27,-2.8; 4 0,-2.8; 5 1.27,-2.8; 6 2.54,-2.8; 7 3.81,-2.8; 8 3.81,2.8; 9 2.54,2.8; 10 1.27,2.8; 11 0,2.8; 12 -1.27,2.8; 13 -2.54,2.8; 14 -3.81,2.8
SO08 = smd 0.6 x 1.2: 1 -1.905,-2.8; 2 -0.635,-2.8; 3 0.635,-2.8; 4 1.905,-2.8; 5 1.905,2.8; 6 0.635,2.8; 7 -0.635,2.8; 8 -1.905,2.8
QFN-20-4X4 = smd 0.65 x 0.3: 1 -1.9,1; 2 -1.9,0.5; 3 -1.9,0; 4 -1.9,-0.5; 5 -1.9,-1; 11 1.9,-1; 12 1.9,-0.5; 13 1.9,0; 14 1.9,0.5; 15 1.9,1 | smd 0.3 x 0.65: 6 -1,-1.9; 7 -0.5,-1.9; 8 0,-1.9; 9 0.5,-1.9; 10 1,-1.9; 16 1,1.9; 17 0.5,1.9; 18 0,1.9; 19 -0.5,1.9; 20 -1,1.9
QFN16 = smd 0.85 x 0.3: 1 -1.475,0.75; 2 -1.475,0.25; 3 -1.475,-0.25; 4 -1.475,-0.75; 9 1.475,-0.75; 10 1.475,-0.25; 11 1.475,0.25; 12 1.475,0.75 | smd 0.3 x 0.85: 5 -0.75,-1.475; 6 -0.25,-1.475; 7 0.25,-1.475; 8 0.75,-1.475; 13 0.75,1.475; 14 0.25,1.475; 15 -0.25,1.475; 16 -0.75,1.475 | smd 1.7 x 1.7: TH 0,0
HVSON8 = smd 0.6 x 0.3: 1 -1.4,0.75; 2 -1.4,0.25; 3 -1.4,-0.25; 4 -1.4,-0.75; 5 1.4,-0.75; 6 1.4,-0.25; 7 1.4,0.25; 8 1.4,0.75 | smd 1.5 x 2.1: EP 0,0
1X03 = drill 1.016 pad 1.88: 1 0,0; 2 2.54,0; 3 5.08,0
YSPIA0850 = smd 2.65 x 3.5: 1 -3.475,0; 2 3.475,0
SOT23-3@1 = smd 0.8 x 0.9: 1 -0.95,-1; 2 0.95,-1; 3 0,1.1
R1206 = smd 1.6 x 1.803: 1 -1.422,0; 2 1.422,0
R0402 = smd 0.6 x 0.7: 1 -0.5,0; 2 0.5,0
4D02 = smd 0.4 x 0.5: 1 -0.8,-0.5; 4 0.8,-0.5; 5 0.8,0.5; 8 -0.8,0.5 | smd 0.3 x 0.5: 2 -0.25,-0.5; 3 0.25,-0.5; 6 0.25,0.5; 7 -0.25,0.5
TACTILE_SWITCH_SMD_4.2X3.2MM = smd 1 x 0.7: 1 -2.25,1.075; 2 2.25,1.075; 3 -2.25,-1.075; 4 2.25,-1.075
XT30_PCB = drill 1.7: 1 -2.5,0; 2 2.5,0 | drill 1: AUX1 -5.5,10; AUX2 5.5,10
JST-PH5 = drill 0.813 pad 1.676 octagon: 1 3.92,0; 2 1.92,0; 3 -0.08,0; 4 -2.08,0; 5 -4.08,0
5033981892 = smd 0.7 x 1.1: 1 0,-0.55; 2 1.1,-0.55; 3 2.2,-0.55; 4 3.3,-0.55; 5 4.4,-0.55; 6 5.5,-0.55; 7 6.6,-0.55; 8 7.7,-0.55 | smd 0.9 x 0.93: DLMA -1.79,-13.015 | smd 1.05 x 0.78: DSMA 2.475,-13.09 | smd 1.14 x 1.83: SMA1 -3.88,-0.565 | smd 0.86 x 2.8: SMA2 8.78,-1.05 | smd 0.7 x 3.3: SMA3 8.75,-11.83; SMA4 -4.1,-11.83
SMA90_DIP = drill 1.5 pad 2.54: ANTENNA 0,0 | drill 1.6 pad 2.54: GND1 -2.54,2.54; GND2 2.54,2.54; GND3 -2.54,-2.54; GND4 2.54,-2.54
JST-PH3 = drill 0.813 pad 1.676 octagon: 1 2.01,0.01; 2 0.01,0.01; 3 -1.99,0.01
JST-PH4 = drill 0.813 pad 1.676 octagon: 1 3,0; 2 1,0; 3 -1,0; 4 -3,0
JST-PH2 = drill 0.813 pad 1.676 octagon: 1 1,0; 2 -1,0
SMD3225 = smd 1.2 x 1.1: 1 -1.175,-0.875; 2 1.175,-0.875; 3 1.175,0.875; 4 -1.175,0.875

### Placement (x,y rotation side)
C1  74.2,50.91 0 top
C2  76.61,47.55 270 top
C3  44.14,7.91 90 top
C4  48,3.62 0 top
C5  61.27,27 90 top
C6  61.32,19.91 0 top
C7  62.42,27 90 top
C8  65.1,24.75 90 top
C9  78.34,49.4 270 top
C10  60.59,42.97 180 top
C11  64.62,19.45 180 top
C12  64.62,20.3 180 top
C13  69.17,23.27 180 top
C14  60.59,40.35 180 top
C15  69.57,42.97 180 top
C16  32.94,2.52 180 top
C17  69.17,24.18 0 top
C18  74.3,22.88 270 top
C19  72.19,41.71 180 top
C20  85.43,42.74 270 top
C21  77.12,22.88 270 top
C22  78.53,22.73 180 top
C23  21.18,44.39 90 top
C24  60.93,14.15 270 top
C25  15.45,44.39 90 top
C26  17.27,48.48 270 top
C27  61.94,14.16 270 top
C28  50.94,4.15 270 top
C29  72.78,26.52 0 top
C30  70.78,26.52 180 top
C31  77.12,24.68 90 top
C32  11.47,48.49 270 top
C33  11.47,51.98 90 top
C34  17.27,52 90 top
C35  74.3,24.68 90 top
C36  8.35,40.61 0 top
C37  25.32,1.5 0 top
C38  32.6,13.32 180 top
C39  84.83,13.84 270 top
C40  65.4,9.28 0 top
C41  58.8,28.05 270 top
C42  74.08,29 180 top
C43  43.17,7.92 90 top
C44  39.65,12.53 180 top
IC1  51.51,16.83 90 top
IC2  73.68,45.67 270 top
IC3  81.5,43.88 0 top
IC4  19.24,43.73 90 top
IC5  13.51,43.74 90 top
IC6  19.24,48.23 270 top
IC7  13.51,48.24 270 top
IC8  18.99,52.24 270 top
IC9  13.26,52.24 270 top
IC10  26.41,9.66 0 top
IC12  62.23,23.07 0 top
IC13  72.03,24.02 0 top
IC14  36.04,7.63 90 top
IC15  48.12,7.9 270 top
IC16  70.24,11.12 270 top
IC17  78.34,11.22 270 top
IC18  83.44,11.22 0 top
J1  7,1.5 90 top
J2  9.5,1.5 90 top
J3  12,1.5 90 top
J4  14.5,1.5 90 top
J5  17,1.5 90 top
J6  19.5,1.5 90 top
L1  62.67,49.05 180 top
L2  66.9,23.27 0 top
L3  65.1,22.8 90 top
L4  65.62,21.27 180 top
L5  75.71,23.77 0 top
L6  78.53,23.77 0 top
Q1  3.15,41.02 0 top
R1  82,49.4 270 top
R2  52,7.9 270 top
R3  23.63,48.73 0 top
R4  23.63,47.83 0 top
R6  78.59,14.97 270 top
R7  77.47,14.97 90 top
R8  44,46.92 270 top
R9  75.72,42.23 0 top
R10  72.19,42.96 180 top
R11  71.32,44.83 90 top
R12  69.57,44.33 0 top
R13  70.62,21.65 0 top
R14  40.64,11.36 180 top
R15  63.42,27 270 top
R16  23.63,52.88 0 top
R17  23.63,51.94 0 top
R18  61.44,15.51 180 top
R19  71.92,20.27 90 top
R20  72.42,21.65 180 top
RN01  81.06,15.18 0 top
RN02  50.57,41.2 270 top
S1  55.81,36.11 0 top
X1  78.82,36.59 270 top
X2  6.58,13.8 180 top
X3  40.41,49.72 270 top
X4  83.08,23.77 0 top
X5  57.35,9.03 90 top
X6  65,35.95 0 top
X7  65,31.2 0 top
X8  76.39,4 270 top
X9  71.64,4 270 top
X10  66.89,4 270 top
X11  62.09,4 270 top
Y1  61.92,17.7 180 top
Y2  41.15,8.87 90 top

### Tracks (layer width: path | path; a pad name or v marks a point on that pad's centre or on a via)
+3.3V  (via drill 0.3)  (5 unrouted)
  Top 0.24: IC8.3 18.74,53.27 v18.21,53.8
  Top 0.25: IC7.8 12.76,46.41 13.09,46.09 14.87,46.09 | 14.87,46.09 14.87,47.74 13.51,47.74 13.51,48.74 IC7.5 12.19,48.74 11.93,49 C32.1 | IC9.3 13.01,53.82 12.83,54 10.35,54 9.76,53.41 | IC9.7 C33.1 v11.47,50.88 C32.1 | C34.1 v17.27,50.88 C26.1 17.68,48.98 17.93,48.73 IC6.5 19.24,48.73 19.24,47.73 IC6.12 20.49,47.73 20.76,47.46 20.76,46.09 18.49,46.09 | 18.49,46.09 14.87,46.09 | IC8.10 20.14,51.48 v20.49,51.13 | IC6.8 18.49,46.09 | IC8.7 17.29,51.48 C34.1 | IC9.10 17.25,51.48 C34.1
  Top 0.28: IC12.18 62.23,25.65 v62.42,25.85 C7.1 | IC13.16 C30.1 | C29.1 IC13.14
  Top 0.3: C20.2 85.06,42.24 84.42,42.88 IC3.6 81.91,42.88 v81.05,42.02 | RN02.5 RN02.6 RN02.7 RN02.8 51.07,45.44 v52.05,46.42 | v80.26,17.54 RN01.8 RN01.7 RN01.6 RN01.5 82.67,15.68 83.44,14.91 83.44,14.05 84.15,13.34 C39.2 IC18.8 | v64.12,24.93 IC12.15 64.5,24.07 64.67,24.25 C8.1 | 19.08,44.05 19.08,43.64 18.84,43.41 IC4.6 17.86,43.41 17.38,43.89 C25.1 14.92,43.89 14.75,44.06 IC5.2 13.41,44.06 | 19.08,44.05 19.08,44.44 18.82,44.7 IC4.8 | 19.08,44.05 IC4.2 20.49,44.05 20.65,43.89 C23.1 | 13.41,44.06 13.41,43.72 13.11,43.41 IC5.6 | 13.41,44.06 13.41,44.44 13.13,44.72 IC5.8 12.01,44.72 11.68,45.04 9.77,45.04 9.75,45.02 | IC12.7 61.73,20.74 61.54,20.56 60.94,20.56 60.82,20.44 C6.1 | v18.21,53.81 v18.21,53.8 | 9.75,44.72 9.75,44.73 | IC5.6 9.75,43.41 9.75,43.39
  Top 0.4: IC15.5 50.94,6 | 43.96,46.47 43.91,46.42
  Top 0.5: 71.28,27.38 C30.1 C29.1 | 50.92,4.65 C28.1 50.94,5.56 | v60.18,25.37 58.8,26.75 C41.2 | C6.1 60.05,19.91 v60,19.96 | v49.88,5.56 50.94,5.56 | IC15.5 50.92,5.56 50.94,5.56 | R16.2 R17.2 R3.2 R4.2 v24.13,45.6 | C23.1 21.74,43.89 23.45,45.6 | C33.1 9.75,51.48 | C32.1 9.71,48.99 9.71,49 | 32.85,46.42 X3.4 R8.2 | C16.1 33.44,3.82 | 33.44,3.82 IC14.14 | 33.44,3.82 35.77,3.82 v36.34,3.25
  Top 0.6: C42.2 71.3,29
  Top 0.8: 71.28,27.38 71.28,28.98 71.3,29
  Top 1: 71.28,31.15 71.22,31.2 X7.1 X6.1
  Top 1.2: 23.45,45.6 v24.13,45.6 v25.02,45.6 32.03,45.6 32.85,46.42 | 9.76,53.41 9.75,53.41 9.75,51.48 9.75,45.02 9.75,44.73 9.75,43.39 C36.2 11.73,40.61 | 11.73,40.61 23.1,40.61 24.14,41.65 24.14,45.63 | IC1.3V3 12.04,40.3 11.73,40.61
  Top 1.4: 71.28,28.98 v71.28,29.29 | v21.75,6.25 21.75,4.78 22.85,3.68 v29.61,3.68 | v59.24,5.56 58.45,4.78 54.82,4.78 54.04,5.56 v49.88,5.56
  Top 2: v71.28,29.29 71.28,31.15 v71.28,39.98
  Route15 0.6: v80.26,17.54 59.24,17.54
  Route15 0.8: v60,19.96 59.24,19.19
  Route15 1.2: 59.24,17.54
  Route15 1.4: v59.24,5.56 59.24,17.54 59.24,19.19
  Route15 1.8: v46.84,46.42 43.81,46.42 42.99,45.6 v25.02,45.6 v24.13,45.6 v24.12,45.6
  Bottom 0.25: v18.21,53.8 20.15,53.8 20.49,53.46 v20.49,51.13 20.24,50.88 v17.27,50.88 v11.47,50.88
  Bottom 0.5: v49.88,5.56 49.88,2.84
  Bottom 0.8: 63.34,25.93 63.26,25.85 v62.42,25.85 60.66,25.85 v60.19,25.37 60.19,20.33 | 63.34,25.93 66.7,29.29 v71.28,29.29 | v64.12,24.93 63.34,25.71 63.34,25.93 | 49.26,2.23 49.88,2.84
  Bottom 1: v49.88,5.56 | v36.34,3.25 37.37,2.23 49.26,2.23
  Bottom 1.2: v29.61,3.68 35.92,3.68 v36.34,3.25
  Bottom 1.4: 61.98,39.98 62.13,39.98 | v21.75,6.25 21.75,8.85 20.54,10.06 4.37,10.06 2.66,11.77 X2.1
  Bottom 2: v81.05,42.02 76.35,42.02 74.3,39.98 v71.28,39.98 62.13,39.98 55.69,46.42 v52.05,46.42 v46.85,46.42 v46.02,46.42
+5V  (via drill 0.3)
  Top 0.3: v28.39,14.15 28.65,13.89 IC10.28 31.53,13.89 C38.2
  Top 0.4: 59.2,46.22 59.2,46.23
  Top 0.5: v44.14,6.63 v44.14,6.64 C3.1 44.28,7.26 IC15.3 | v45.38,3.62 C4.1
  Top 0.6: R11.2 71.32,46.28 71.06,46.54 68.21,46.54 | 59.3,45.75 59.2,45.86
  Top 0.8: 68.21,46.54 67.42,45.75 59.3,45.75 | Q1.3 v3.15,43.84
  Top 1.2: C37.2 v28.29,1.5
  Top 1.6: C14.2 C10.2 59.2,45.86 59.2,46.23 L1.2 | v54.34,40.35 53.94,40.35
  Top 1.8: C14.2 v56,40.35
  Top 2: v56,40.35 v55.16,40.35 v54.34,40.35 v53.5,40.35
  Top 2.5: v5.12,43.84 v4.11,43.84 v3.15,43.84
  Route15 1.2: 45.38,1.5 v45.38,3.62
  Route15 1.8: v28.39,14.15 28.11,13.87 28.11,1.5
  Route15 2: J1.2 J2.2 J3.2 J4.2 J5.2 J6.2 21.98,4.04 24.52,1.5 28.11,1.5 v28.29,1.5 45.38,1.5 52,1.5 53.5,3
  Route15 2.4: v3.15,43.84 6.85,43.84 10.34,40.35
  Route15 3: 10.34,40.35 v54.34,40.35 | 53.5,3 v53.5,40.35 v56,40.35
  Bottom 0.5: v45.38,3.62 45.38,5.4 v44.14,6.63
+12V  (via drill 0.3)
  Top 0.3: IC16.9 67.34,10.62 v66.96,10.25 65.99,9.28 C40.2 | IC17.1 79.09,13.61 79.49,14.01 v79.49,16.3 | v83.85,46.39 83.85,44.88 IC3.10
  Top 0.5: v77.47,16.3 R7.2
  Top 1.6: v83.85,47.98 | R1.2 v83.85,47.98
  Top 2: v83.85,47.98 v83.85,46.39
  Route15 1: v79.49,16.3 88.24,16.3
  Route15 1.2: X11.1 62.23,2.86 62.23,1.87 | 66.9,1.87 66.9,2.99 X10.1 66.17,2.28 v64.91,2.28 | X9.1 71.81,2.83 71.81,1.87 | X8.1 76.5,2.89 76.5,1.87
  Route15 2.4: 83.85,32.29 88.24,27.9 88.24,16.3 88.24,9.25 80.86,1.87 76.5,1.87 71.81,1.87 66.9,1.87 62.23,1.87 62.08,1.87
  Route15 3: v83.85,46.39 83.85,39.09 | 83.85,39.09 83.85,32.29 | X1.1 83.85,39.09
  Bottom 0.5: v79.49,16.3 v77.47,16.3
  Bottom 1.2: v66.96,10.25 64.91,8.2 v64.91,2.28
  Bottom 2: v83.85,47.98 v83.85,47.19 v83.85,46.39
ANT1
  Top 0.3: L4.1 66.12,22.06 65.89,22.3 L3.1 64.78,22.3 64.5,22.57 IC12.12
ANT2  (1 unrouted)
  Top 0.28: 65,23.2 L3.2
  Top 0.3: 65.15,23.27 L2.1 | IC12.13 64.53,23.07 64.75,23.3 L3.2
CAN1_H  (via drill 0.3)
  Top 0.5: v49.96,8.54 IC15.7 51.87,8.54 R2.1
  Bottom 0.5: X5.1 54.84,8.54 v49.96,8.54
CAN1_L  (via drill 0.3)
  Top 0.3: 52.02,7.26 52.02,7.38 R2.2
  Top 0.5: v49.96,7.26 IC15.6 52.02,7.26
  Bottom 0.5: v49.96,7.26 55.57,7.26 X5.2
CAN_CS\  (via drill 0.3)
  Top 0.4: v40,15.06 39.98,15.08
  Top 0.5: 39.98,15.08 IC1.GP12 | IC14.13 v35.09,5.09 v35.1,5.09
  Route2 0.4: v40,15.05 v40,15.06
  Route2 0.5: v40,15.06 40,10.79 35.1,5.89 v35.1,5.09
CAN_INT\  (via drill 0.3)
  Top 0.3: v50.16,14.08 50.14,14.1
  Top 0.5: 50.14,14.1 IC1.GP15 | IC14.4 38.5,7.63 v37.46,6.59
  Route15 0.3: v50.16,14.07 v50.16,14.08
  Route15 0.5: v37.46,6.59 42.68,6.59 v50.16,14.07
DCDC_BOOT  (via drill 0.3)
  Top 0.24: IC2.9 74.18,43.52 v74.37,43.33
  Top 0.6: C2.2 v76.61,45.81
  Bottom 1: v76.61,45.81 76.61,44.88 75.06,43.33 v74.37,43.33
DCDC_COMP
  Top 0.24: IC2.7 73.18,43.45 R10.1 C19.1
DCDC_PH  (via drill 0.3)
  Top 0.24: v74.17,49.8 v74.18,49.8 v74.18,49.05 v74.18,48.32 IC2.2
  Top 0.5: v71.11,48.31 v71.11,49.05 v71.11,49.8
  Top 0.6: C2.1 v76.61,49.05
  Top 2.4: L1.1 v71.11,49.05
  Bottom 2.4: v76.61,49.05 v74.18,49.05 v71.11,49.05
DCDC_RT
  Top 0.24: IC2.10 74.68,43.98 75.22,43.45 R9.1
DVDD
  Top 0.3: IC12.19 61.73,25.57 61.27,26.02 C5.1
FILTER1
  Top 0.28: L6.1 L5.2 77.12,23.77 C21.1 C31.1
GND  (via drill 0.3, 3.2 pad 3.81)
  Top 0.24: IC2.4 IC2.3 73.68,45.69 | IC3.7 82.12,43.38 81.12,44.38 IC3.2 IC3.1 79.3,45.39 v78.12,46.56
  Top 0.25: 18.23,47.98 IC6.6 IC6.7 18.23,47.98 | 12.5,47.99 IC7.7 | 12.5,47.99 IC7.6 | C32.2 12.5,47.99 | IC8.8 IC8.9 19.24,50.97 19.99,50.22 IC6.1 v20.5,49.49 | IC9.8 IC9.9 13.51,50.96 14.26,50.21 IC7.1 | IC7.1 14.26,49.81 | 18.23,47.98 C26.2 | IC9.1 14.6,53 v14.82,53.22 | IC8.1 20.97,53 v21.18,53.21 | 11.47,45.99 v11.16,45.99 | IC9.4 11.47,53 | 11.47,53 C33.2 | v11.47,53.24 11.47,53 | IC8.4 17.27,53 | C34.2 17.27,53 | 17.27,53 v17.27,53.24 | 11.32,44.06 v11.15,44.24 | IC7.1 14.26,49.89 v14.56,50.19
  Top 0.28: IC13.8 IC13.7 | IC13.12 IC13.11 72.28,24.27 IC13.17 | IC13.17 71.78,23.77 IC13.3 IC13.2 IC13.1 70.56,24.85 70.28,24.85 | IC13.15 71.78,24.27 IC13.17 | 72.78,23.27 IC13.17 | 72.78,23.27 IC13.8 | C17.1 68.67,24.85 | IC13.8 72.78,21.8 R20.1 | 72.78,23.27 IC13.9
  Top 0.3: IC12.14 62.73,23.57 | IC12.17 62.73,23.57 | 62.73,23.57 IC12.0 | IC12.20 61.23,24.07 v61.65,23.65 IC12.0 | IC12.0 IC12.8 62.23,20.31 C6.2 | C12.2 C11.2 | IC18.4 v82.04,10 | IC13.12 73.48,25.18 | 73.48,25.18 73.48,25.77 73.28,25.98 C29.2 | IC3.7 85.3,43.38 C20.1 | 68.67,24.85 70.28,24.85 C30.2 | 17.84,45.17 18,45.33 19.86,45.33 20.04,45.16 IC4.1 20.5,44.7 20.69,44.89 C23.2 21.2,44.92 | 17.84,45.17 17.84,44.89 | 17.84,44.89 17.84,44.23 18.02,44.05 IC4.7 | IC17.12 79.09,9.18 v79.59,8.68 | IC10.23 IC10.24 | IC10.1 IC10.2 IC10.3 IC10.4 IC10.5 | IC10.24 26.41,11.29 | 26.41,11.29 25.81,11.29 | IC10.24 IC10.25 | C26.2 17.27,47.45 v17.66,47.05 | 17.84,45.17 17.84,45.18 v17.71,45.3 | C18.2 C21.2 | 73.48,25.18 C35.2 C31.2 | IC10.14 24.76,5.44 | C39.1 84.83,17.58 83.89,18.52 78.6,18.52 78.59,18.51 | IC16.8 66.88,11.12 | 11.47,45.99 11.95,45.51 13.07,45.51 13.87,44.72 IC5.1 14.79,44.72 14.96,44.89 C25.2 17.84,44.89 | IC5.5 11.4,42.77 v11.16,42.52 | IC5.7 11.32,44.06 | C32.2 11.47,47.26 11.16,46.95 v11.16,45.99 | v26.41,11.88 26.41,11.29 | IC4.5 v17.5,42.76
  Top 0.4: v74.41,45.67 76.22,43.87 R9.2 76.22,41.62 74.91,40.31 v74.91,35.03 | C5.2 C7.2 R15.1 | 50.94,3.62 C28.2 | R6.1 78.59,18.51 78.59,21.23 78.6,21.23 | X4.GND3 78.6,21.23 | C21.2 78.03,22.38 C22.2 78.03,21.81 78.6,21.23 | v50.1,11.05 45.22,11.05 | 44.14,10.87 v45.04,10.87 | C27.2 61.93,12.78 v64.29,10.43 64.9,10.43 | 64.9,10.43 65.58,10.43 66.28,11.12 66.88,11.12 | C40.1 64.9,10.43 | C11.2 64.12,18.94 64.62,18.44 v64.62,16.03 | 61.99,37.31 61.87,37.18 S1.2 S1.1 | 19.64,20.08 19.66,20.06 IC1.GND@2 | v57.23,15.89 59.47,13.65 C24.2
  Top 0.5: 73.06,45.69 73.05,45.67 v72.93,45.67 | X4.GND1 X4.GND2 X4.GND4 X4.GND3 | R15.1 64.5,27.5 65.1,26.9 C8.2 | 24.76,5.44 v25.43,6.1 25.81,6.49 25.81,11.29 24.51,12.59 IC10.3 19.66,12.59 | 50.94,3.62 C4.2 48.5,6.74 v48.24,7 | 45.22,11.05 v45.04,10.87 | C5.2 61.27,27.96 60.69,28.55 C41.1 | C3.2 | IC15.2 44.27,8.54 C3.2 | C3.2 v44.14,9.41 44.14,10.87 44.14,13.32 | C43.2 C3.2 | C27.2 C24.2 | X3.6 43.41,44.22 45.04,42.59 45.04,36.2 | 73.63,50.84 73.06,50.84 v73.06,51.47 v73.05,51.47 | 44.14,13.32 44.14,13.42 45.06,14.34 IC1.GND@4 | 19.66,12.59 IC1.GND@2 | 19.66,12.59 11.88,12.59 X2.5 | IC14.7 38.84,12.22 C44.2 39.15,13.32 | IC1.GND@3 32.36,15.55 33.1,14.81 C38.1 36.16,13.32 | 36.16,13.32 39.15,13.32 | 39.15,13.32 44.14,13.32 | v36.16,12.29 36.16,13.32 | v32.08,5.03 32.08,2.87 C16.2
  Top 0.6: C19.2 69.63,41.71 69.07,42.27 C15.2 | C15.2 R12.1 v68.05,44.33 | C15.2 v68.04,42.97 | C42.1 75.99,29
  Top 0.7: v68.04,42.97 C10.1
  Top 0.8: 3,3 v2.75,2.75 | C9.2 78.34,46.78 v78.12,46.56 | 75.99,29 78.67,26.32 X4.GND1 | C36.1 v5.56,40.61 v5.55,40.62
  Top 1: 73.18,45.67 IC2.11 | 73.06,45.69 73.68,45.69 | C14.1 61.99,37.31 X6.4 X7.4
  Top 1.1: 73.06,50.84 73.06,45.69
  Top 1.2: 19.64,18.42 19.64,20.08 19.64,37.11 IC1.AGND | IC1.GND@1 IC1.GND@8 C36.1 | IC1.GND@7 IC1.GND@3 | IC1.GND@6 45.06,27.11 | 45.06,27.11 IC1.GND@4 | IC1.GND@5 45.28,27.33 45.06,27.11
  Top 1.4: C10.1 C14.1
  Top 1.6: C37.1 21.25,1.5
  Top 2: J6.1 21.25,1.5 21.5,1.5
  Route2 0.25: v11.15,42.53 v11.16,42.52 | v21.18,53.21 20.83,53.21 19.67,52.05 19.67,50.32 v20.5,49.49 18.02,47.01 17.71,47.01 v17.71,45.3 17.71,42.98 | v11.16,45.99 11.3,45.99 | v11.47,53.24 14.8,53.24 v14.82,53.22 14.56,52.96 v14.56,50.19 14.56,49.39 v11.16,45.99 | v11.15,44.24 v11.15,45.98 v11.16,45.99
  Route2 0.3: v11.16,44.25 v11.15,44.24
  Route2 0.4: v17.66,47.05 17.71,47.01 | v17.5,42.76 17.71,42.98 | v50.1,11.05 53.33,11.05 X5.3
  Route2 0.5: v11.15,44.24 v11.15,42.53 | v32.08,5.03 26.5,5.03 v25.43,6.1
  Route2 0.8: v5.55,40.62 7.45,42.52 v11.16,42.52
  Route15 0.25: v17.27,53.24 14.84,53.24 v14.82,53.22
  Bottom 0.3: v82.04,10 80.71,8.68 | 78.81,34.08 77.85,35.03 v74.91,35.03
  Bottom 0.4: 78.81,34.08 X1.2 | 80.71,8.68 v79.59,8.68 78.73,7.82 77.27,7.82 75.48,9.61 75.01,9.61 74.53,10.09 74.53,13.42 71.92,16.03 v64.62,16.03 57.37,16.03 v57.23,15.89 | v44.14,9.41 45.83,9.41 v48.24,7
  Bottom 0.5: v64.29,10.43 60.9,7.04 X5.3 | v26.41,11.89 35.77,11.89 v36.16,12.29
  Bottom 0.6: v68.05,44.33 68.05,44.56 v68.91,45.42 69.16,45.66 v69.7,45.66 73.66,45.66 | v78.12,46.56 77.59,47.09 74.99,47.09 74.41,46.51 v74.41,45.67 IC2.11
  Bottom 1.6: X1.2 78.82,30.39 80.53,28.68 X4.GND1
  Bottom 2: J6.1 J5.1 J4.1 J3.1 J2.1 J1.1 4,1.5 v2.75,2.75
  other vias: 2.75,52.25 87.25,52.25 87.25,2.75 73.68,45.67 62.8,23.65 61.65,22.5 62.8,22.5 67,22.12 66.06,19.48 68.24,20.39 68.05,25.01 68.7,22.25 66.89,24.27 72.03,24.02 75.71,24.81 75.71,22.78 78.93,24.77 75.69,22 75.71,25.69 66.85,19.48 67.64,19.8 67.83,22.22 74.89,21.73 74.08,21.61 73.64,20.95 72.87,20.8 72.87,20.01 69.03,20.61 69.85,20.62 70.69,20.62 78.83,21.75 78.02,21.79 77.27,21.63 76.48,21.82 67.76,24.3 68.71,25.42 69.52,25.42 72.87,19.2 72.14,18.81 71.3,18.69 79.89,23 80.64,23.02 81.38,22.9 81.33,24.61 80.53,24.55 79.72,24.62 78.09,24.81 69.4,26.18 74.88,25.91 74.11,26.23 74.09,27.01 73.34,27.47 72.47,27.48 66.03,24.24 66.02,25.07 65.96,25.87 65.94,26.65 69.4,27 70.09,27.43 75.13,24.8 76.29,24.83 76.48,25.92 77.31,26.01 77.96,25.53 75.13,22.78 76.29,22.78
  pour Bottom (isolate 0.305): 90,52.5 90,2.5 arc-90 87.5,0 2.5,0 arc-90 0,2.5 0,52.5 arc-90 2.5,55 87.5,55 arc-90
  pour Top (isolate 0.305): 90,52.5 90,2.5 arc-90 87.5,0 2.5,0 arc-90 0,2.5 0,52.5 arc-90 2.5,55 87.5,55 arc-90
  pour Route15 (isolate 0.305): 90,52.5 90,2.5 arc-90 87.5,0 2.5,0 arc-90 0,2.5 0,52.5 arc-90 2.5,55 87.5,55 arc-90
  pour Route2 (isolate 0.305): 90,52.5 90,2.5 arc-90 87.5,0 2.5,0 arc-90 0,2.5 0,52.5 arc-90 2.5,55 87.5,55 arc-90
IREF
  Top 0.3: IC12.16 63.23,26.3 R15.2
MISO1  (via drill 0.3)
  Top 0.3: IC12.5 59.33,22.07 v58.94,21.68 | v27.29,20.9 v27.28,20.89 IC1.GP8
  Top 0.5: IC14.12 v32.1,6.36
  Route2 0.5: v27.29,20.9 27.29,7.38 28.31,6.36 v32.1,6.36
  Bottom 0.4: v58.94,21.68 28.07,21.68 v27.29,20.9
MOSI1  (via drill 0.3)
  Top 0.3: IC12.4 58.58,22.57 v58.53,22.53 | v37.42,22.51 37.44,22.49
  Top 0.5: 37.44,22.49 IC1.GP11 v37.44,15.06 | IC14.11 35.28,7.63 v35.3,7.65
  Route2 0.5: v37.44,15.06 37.44,9.79 v35.3,7.65
  Bottom 0.4: v37.42,22.51 58.51,22.51 v58.53,22.53
N$6
  Top 0.5: R10.2 C15.1
NRF_CE  (via drill 0.3)
  Top 0.3: IC12.1 60.04,24.07 59.08,25.04 v57.72,25.04
  Top 0.4: R19.1 71.16,19.77 69.88,18.49 v67.65,18.49 | v57.7,18.48 57.7,25.01 v57.72,25.04 | v29.83,20.17 IC1.GP9
  Bottom 0.4: v29.84,20.18 v29.83,20.17 30.6,20.94 50.39,20.94 52.85,18.48 v57.7,18.48 v67.65,18.48 v67.65,18.49
NRF_CS  (via drill 0.3)
  Top 0.3: IC12.2 59.79,23.57 59.24,24.12 v58.46,24.12 | 42.52,24.11 v42.5,24.12
  Top 0.5: IC1.GP13 42.52,24.11
  Bottom 0.4: v42.5,24.12 v58.46,24.12
NRF_INT  (via drill 0.3)
  Top 0.3: IC12.6 59.56,21.18 v59.15,20.76
  Top 0.4: v56.76,20.77 56.76,27.94 58.18,29.36 v58.18,31.5
  Top 0.5: v50.14,34.75 IC1.GP16
  Bottom 0.4: v56.76,20.77 v59.15,20.77 v59.15,20.76
  Bottom 0.5: v50.14,34.75 57.56,34.75 58.18,34.13 v58.18,31.5
NRF_SIGNAL
  Top 0.5: L2.2 C13.2
OSC1_40MHZ
  Top 0.5: C44.1 R14.2 40.14,10.17 Y2.3 40.14,10.17 IC14.6
OSC2_40MHZ
  Top 0.3: R14.1 41.14,8.9 41.06,8.9
  Top 0.5: IC14.5 41.06,8.9 | C43.1 42.3,7.42 Y2.1 42.02,8.02 41.14,8.9
PA_ANT  (1 unrouted)
  Top 0.28: IC13.10 74.3,23.77
  Top 0.3: L5.1 74.3,23.77 C35.1
PPS  (via drill 0.3)
  Top 0.4: 17.1,37.11 IC1.GP28_A2
  Top 0.5: v17.1,34.21 17.1,37.11
  Bottom 0.5: X2.4 8.66,25.77 v17.1,34.21
PYRO_IN1  (via drill 0.3)
  Top 0.3: IC16.18 IC16.19 72.91,11.62 v73.04,11.5
  Top 0.4: v45.1,12.24 v50.1,12.24 | v23.29,15.25 22.2,16.34 IC1.GP6
  Bottom 0.4: v73.04,11.5 72.3,12.24 v50.1,12.24 | v23.29,15.25 32.01,15.25 33.25,14.01 43.33,14.01 v45.1,12.24
PYRO_IN2  (via drill 0.3)
  Top 0.3: IC16.1 70.99,13.03 IC16.2 | v24.73,20.39 v24.74,20.38
  Top 0.5: 70.99,13.03 71,13.04 v71,14.64 | v24.74,20.38 IC1.GP7
  Bottom 0.3: 24.77,20.39 v24.73,20.39
  Bottom 0.5: v71,14.64 70.64,14.99 49.99,14.99 47.36,17.62 27.54,17.62 24.77,20.39
PYRO_IN3  (via drill 0.3)
  Top 0.3: IC16.4 70,13.03 IC16.3
  Top 0.4: v57.23,32.71 57.23,29.54 55.59,27.9 55.59,15.44 v57.1,13.94
  Top 0.5: v70,13.9 70,13.03 | IC1.GP27_A1 22.2,33.93 v23.37,32.76
  Bottom 0.4: 69.97,13.93 v70,13.9 69.97,13.94 v57.1,13.94 | 57.18,32.76 v57.23,32.71
  Bottom 0.5: v23.37,32.76 57.18,32.76
PYRO_IN4  (via drill 0.3)  (1 unrouted)
  Top 0.3: IC16.6 68.34,12.62 68.5,12.79 | 68.5,12.79 68.74,13.03 IC16.5 | 68.5,12.79 68.44,12.79 v68.11,13.12
  Top 0.4: v56.85,33.81 56.37,33.34 56.37,29.94 54.72,28.29 54.72,15.03 v56.62,13.13
  Top 0.5: 24.74,33.82 IC1.GP26_A0
  Bottom 0.4: 56.84,33.8 v56.85,33.81 | v56.62,13.13 v68.1,13.13 v68.11,13.12
  Bottom 0.5: v24.75,33.8 56.84,33.8
PYRO_OUT1
  Top 0.3: IC17.4 76.31,12.7 75.86,13.15 75.06,13.15 74.46,12.55 74.46,11.65 73.44,10.62 IC16.17 IC16.16
  Top 0.8: 73.88,6.31 73.88,7.14 72.14,8.88 IC16.16
  Top 1: 73.88,6.31 75.19,5 X8.2
PYRO_OUT2  (via drill 0.3)
  Top 0.3: IC16.14 IC16.15 71.16,9.15 70.99,9.15 | IC17.6 75.34,11.47 74.28,10.42 74.28,8.05 75.11,7.22 v75.34,7.22 | v72.19,7.22 71.69,7.22 71.64,7.17
  Top 0.8: 71.64,7.17 70.99,7.83 70.99,9.15
  Top 1: X9.2 71.64,7.17
  Bottom 0.3: v75.34,7.22 v72.19,7.22
PYRO_OUT3  (via drill 0.3)
  Top 0.3: IC16.12 IC16.13 70.16,9.15 69.99,9.15 | 69.96,7.9 69.99,7.88 | v69.36,8.28 69.79,8.28 69.99,8.47 | v75.19,8.62 76.86,10.3 IC17.8
  Top 0.8: 69.99,7.88 69.99,8.47 69.99,9.15 | 69.25,7.33 69.83,7.9 69.96,7.9
  Top 1: X10.2 69.21,7.33 69.25,7.33
  Bottom 0.4: v69.36,8.28 74.84,8.28 v75.19,8.62
PYRO_OUT4  (via drill 0.3)
  Top 0.3: IC16.10 68.34,9.45 68.56,9.22 | 68.56,9.22 68.24,9.22 | 68.56,9.22 IC16.11 | IC17.11 v78.59,6.36 | v67.35,8.03 66.91,8.47 66.91,8.54
  Top 0.8: 68.24,9.22 67.59,9.22 66.91,8.54 66.2,7.84
  Top 1: X11.2 64.92,7.84 66.2,7.84
  Bottom 0.3: v78.59,6.36 69.01,6.36 v67.35,8.03
PYRO_SENSE1
  Top 0.3: 82.09,11.97 IC18.1 82.04,12.47 79.89,12.47 79.81,12.4 IC17.16 | IC17.16 79.81,12.35 | RN01.1 80.26,13.96 79.81,13.51 IC17.16
PYRO_SENSE2  (via drill 0.3)
  Top 0.3: IC18.2 80.71,11.47 | 80.71,11.47 IC17.15 | RN01.2 80.81,13.28 v80.76,13.22 | v80.76,11.72 80.76,11.53 80.71,11.47
  Bottom 0.3: v80.76,13.22 v80.76,11.72
PYRO_SENSE3  (via drill 0.3)
  Top 0.3: IC17.14 81.01,10.97 | 81.01,10.97 IC18.3 | RN01.3 81.31,13.91 v81.56,13.66 | v80.99,10.75 80.99,10.95 81.01,10.97
  Bottom 0.3: v81.56,13.66 81.56,11.32 v80.99,10.75
PYRO_SENSE4  (via drill 0.3)
  Top 0.3: 79.99,10.47 IC17.13 79.81,9.75 80.41,9.15 v83.29,9.15 84.06,9.15 84.84,9.93 IC18.5 | RN01.4 81.86,14.41 v82.54,13.74
  Bottom 0.3: v83.29,9.15 83.29,12.99 v82.54,13.74
RUN  (via drill 0.3)
  Top 0.4: S1.4 S1.3 53.45,35.03
  Top 0.5: 53.45,35.03 52.67,35.03 49.29,31.65 v47.44,31.65 | v27.32,31.65 27.32,37.09 IC1.RUN
  Bottom 0.5: v47.44,31.65 v27.32,31.65
RXCAN1
  Top 0.4: IC15.4 44.56,6 43.66,5.09 IC14.2
RXEN
  Top 0.28: IC13.6 71.78,21.8 R20.2 R19.2
SCL0  (via drill 0.3)
  Top 0.25: IC6.13 20.96,48.23 v21.35,47.84 | IC8.12 20.61,52.49 v21.36,51.74
  Top 0.3: IC3.5 78.39,42.88 78.13,42.62 78.13,41.18 | 30.69,1.35 30.69,12.28 30.38,12.59 IC10.26 v25.83,12.59 | IC18.6 86.52,10.97 | v17.16,21.38 17.12,21.34 | IC4.4 20.41,42.76 20.73,42.44 v21.35,42.44 | v21.35,47.84 21.36,47.83 R4.1
  Top 0.4: v17.13,13.8 v17.12,13.81
  Top 0.5: 30.69,1.35 31.21,0.82 31.44,0.6 80.54,0.6 86.52,6.58 86.52,10.97 86.52,12.26 88.62,14.36 88.62,28.18 86.34,30.46 78.23,30.46 76.87,31.82 v76.87,32.59 76.87,39.92 78.13,41.18 | 17.12,21.34 IC1.GP5 v17.12,13.81
  Route2 0.25: 21.35,51.73 v21.36,51.74
  Route2 0.3: 20.13,12.59
  Route2 0.5: v17.16,21.38 21.35,25.57 v21.35,42.44 v21.35,47.84 21.35,51.73 | 20.13,12.59 18.92,13.8 v17.13,13.8 | v25.83,12.59 20.13,12.59
  Bottom 0.5: v76.87,32.59 67.39,32.59 X7.2
SCL1  (via drill 0.3)
  Top 0.25: v23.13,51.22 R17.1 | IC7.13 15.37,48.24 v15.52,48.09 | IC9.12 v15.52,52.48
  Top 0.3: IC5.4 14.71,42.77 14.96,42.52 v15.52,42.52
  Top 0.5: IC1.GP3 v12.04,20.12
  Route2 0.5: v15.52,52.48 v15.52,48.09 v15.52,42.52 15.52,39.8 12.04,36.32 v12.04,20.12
  Route15 0.25: v15.52,52.48 21.86,52.48 v23.13,51.22
  Route15 0.3: v23.13,51.22 59.33,51.22 66,44.55 X6.2
SCLK1  (via drill 0.3)
  Top 0.3: IC12.3 59.27,23.07 v59.06,23.29
  Top 0.4: IC1.GP10
  Top 0.5: IC1.GP10 v34.9,23.25 | v34.89,15.16 IC1.GP10 | IC14.10 34.87,8.9 v34.89,8.88
  Route2 0.4: v34.88,15.15 v34.89,15.16
  Route2 0.5: v34.88,15.15 v34.88,8.89 v34.89,8.88
  Bottom 0.3: v34.9,23.25 34.94,23.29
  Bottom 0.4: 34.94,23.29 v59.06,23.29
SD_CLK
  Top 0.4: IC1.GP17 47.6,38.98 46.35,40.23 46.35,42.53 43.56,45.32 X3.5
SD_CMD  (via drill 0.3)
  Top 0.5: IC1.GP18 42.51,37.14 v42.51,43.12 | X3.3 v42.51,47.52 43.9,47.52 R8.1
  Bottom 0.5: v42.51,47.52 v42.51,43.12
SD_DAT0  (via drill 0.3)
  Top 0.3: RN02.3 49.14,40.95 48.97,41.12 48.97,44.08 v48.54,44.51
  Top 0.4: X3.7 v40.99,43.12 | v40.99,43.12 | IC1.GP19 39.98,38.35 41.28,39.65 41.28,42.84 v40.99,43.12
  Route15 0.4: v48.54,44.51 44.19,44.51 43.73,44.05 41.92,44.05 v40.99,43.12
SD_DAT1  (via drill 0.3)
  Top 0.3: v47.84,43.49 48.34,42.99 48.34,40.79 | v37.97,42.65 38.06,42.56 38.06,42.02
  Top 0.4: RN02.4 48.73,40.4 48.34,40.79
  Top 0.5: IC1.GP20 37.44,41.5 37.96,42.02 38.06,42.02 X3.8
  Route15 0.3: 38.19,42.65 v37.97,42.65
  Route15 0.4: 38.19,42.65 40.17,42.65 40.48,42.34 43.73,42.34 44.88,43.49 v47.84,43.49
SD_DAT2  (via drill 0.3)
  Top 0.4: RN02.1 50.07,46.58 46.92,49.72 X3.1 v34.88,49.72
  Top 0.5: IC1.GP21 34.88,37.15 v34.88,43.03
  Route2 0.5: v34.88,43.03 v34.88,49.72
SD_DAT3  (via drill 0.3)
  Top 0.3: X3.2 46.65,48.62 49.49,45.78 49.48,45.77 49.48,41.53 49.56,41.45 RN02.2
  Top 0.4: 29.8,38.27 29.82,38.27 IC1.GP22
  Top 0.5: v31.09,48.62 X3.2 | 29.8,38.27 31.09,39.56 v31.09,42.9
  Route2 0.5: v31.09,42.9 v31.09,48.62
SDA0  (via drill 0.3)  (1 unrouted)
  Top 0.25: IC8.2 19.24,53.45 19.75,53.97 | IC6.14 v22.22,48.73 R3.1
  Top 0.3: IC18.7 85.36,11.47 v85.71,11.82 | IC3.4 77.88,43.38 77.31,42.81 77.31,41.54 | 31.34,1.75 31.34,12.45 30.55,13.24 IC10.27 26.51,13.24 v26.08,13.67 | v14.58,20.31 14.58,20.28 | IC1.GP4 | IC4.3 20.5,43.41 20.76,43.15 v22.22,43.15 | 19.75,53.97 21.95,53.97 v22.21,53.7
  Top 0.5: v85.71,11.82 85.71,12.8 87.58,14.66 87.58,27.65 85.72,29.5 77.61,29.5 75.88,31.24 v75.88,33.48 75.88,40.1 77.31,41.54 | 31.34,1.75 31.66,1.43 80.13,1.43 85.7,6.99 v85.7,9.91 | 14.58,20.28 IC1.GP4 | v14.59,14.63 IC1.GP4
  Route2 0.3: 22.22,43.05 v22.22,43.15
  Route2 0.5: v14.58,20.31 17.92,20.31 22.22,24.61 v22.22,43.15 | 22.21,43.21 v22.21,48.73 v22.22,48.73 v22.21,48.74 v22.21,53.7 | v26.08,13.67 20.46,13.67 19.5,14.63 v14.59,14.63
  Bottom 0.3: v85.7,9.91 85.71,9.93
  Bottom 0.5: 85.71,9.93 v85.71,11.82 | X7.3 66.28,33.48 v75.88,33.48
SDA1  (via drill 0.3)
  Top 0.25: IC5.3 14.81,43.41 14.98,43.24 16.21,43.24 v16.36,43.09 | IC7.14 15.04,48.74 15.21,48.91 v16.33,48.91 | IC9.2 13.51,53.79 13.72,54.01 v16.33,54.01 16.66,54.01 17.16,54.5 22.71,54.5 23.13,54.08 R16.1
  Top 0.5: IC1.GP2 9.5,20.41 10.78,21.69 13.4,21.69 v13.42,21.71
  Route2 0.25: v16.36,43.09 16.33,43.12
  Route2 0.5: v16.33,54.01 v16.33,48.91 16.33,43.12 | v13.42,21.71 13.42,35.6 16.36,38.55 v16.36,43.09
  Route15 0.25: 58.75,50.53 24.23,50.53 23.89,50.19 17.61,50.19 v16.33,48.91
  Route15 0.3: 58.75,50.53 64,45.28 X6.3
SERVO0
  Top 0.3: J1.3 11.06,10.64 IC10.6
SERVO1
  Top 0.3: J2.3 12.91,9.99 IC10.7
SERVO2
  Top 0.3: J3.3 14.76,9.34 IC10.8
SERVO3
  Top 0.3: J4.3 16.61,8.69 IC10.9
SERVO4
  Top 0.3: J5.3 18.46,8.04 IC10.10
SERVO5
  Top 0.3: J6.3 20.31,7.39 IC10.11
SMA_RF
  Top 0.4: C22.1 L6.2 X4.ANTENNA
TXCAN1
  Top 0.4: IC15.1 46.32,9.8 46.67,9.45 46.67,5.55 46.21,5.09 44.92,5.09 43.66,3.82 IC14.1
TXEN
  Top 0.28: IC13.5 71.28,21.8 R13.2
TXRX
  Top 0.28: IC13.4 C13.1 C17.2
UART0_RX  (1 unrouted)
  Top 0.4: 4.4,16.35 4.42,16.35
  Top 0.5: IC1.GP1 4.42,16.04 X2.3
UART0_TX
  Top 0.4: 1.86,17.17 1.88,17.17 IC1.GP0
  Top 0.5: 1.86,17.17 1.86,16.6 X2.2
UREF  (via drill 0.3)
  Top 0.3: IC17.5 75.89,11.97 v75.49,12.38 | IC17.7 75.94,10.97 v75.49,10.53 | IC17.2 R6.2 | IC17.9 77.59,9.11 v77.41,8.93
  Top 0.5: 78.03,14.47 R6.2 | R7.1 78.03,14.47 | 78.03,14.47 v78.03,13.88
  Bottom 0.4: v78.03,13.88 76.99,13.88 v75.49,12.38 v75.49,10.53 77.08,8.93 v77.41,8.93
VBUS
  Top 0.8: IC1.VBUS 1.88,39.7 Q1.1
VDD_PA
  Top 0.3: C12.1 L4.2 64.42,21.27 64.12,21.57 IC12.11 | C11.1 C12.1 | C12.1 66.97,20.3 68.12,21.45 69.92,21.45 R13.1
VIN
  Top 0.24: IC2.1 75.16,47.03 75.16,47 75.27,46.89 | 75.12,47.03 75.16,46.99 | IC3.8 IC3.9 82.12,44.38 80.4,46.1
  Top 0.3: 80.4,46.1 80.4,50.82 80.63,50.82
  Top 0.6: C1.2 75.08,50.91 75.16,50.84
  Top 0.75: 75.16,50.84 75.16,47 75.16,46.99
  Top 1.2: 75.16,50.84 78.34,50.84 C9.1
  Top 1.6: C9.1 79.81,50.8 79.83,50.82 80.63,50.82 R1.1
VSENSE
  Top 0.24: R11.1 IC2.6
  Top 0.4: R11.1 R12.2
VSYS
  Top 0.8: IC1.VSYS 4.42,39.7 Q1.2
XC1_16MHZ
  Top 0.3: IC12.10 63.23,18.71 Y1.1 63.09,18.47 61.94,17.32 R18.1
  Top 0.5: R18.1 C27.1
XC2_16MHZ
  Top 0.3: IC12.9 62.73,19.75 61.91,18.93 61.91,18.02 60.74,16.86 Y1.3
  Top 0.5: Y1.3 60.94,16.63 R18.2 C24.1
XSTBY0  (via drill 0.3)
  Top 0.4: IC15.8 47.6,9.8 v47.59,9.82 | v47.59,14.99 IC1.GP14
  Top 0.5: IC1.GP14
  Bottom 0.4: v47.59,9.82 v47.58,9.82 v47.58,14.98
  Bottom 0.5: v47.58,14.98 v47.59,14.99

### Text on the board
tPlace: FARduino pico v0.1 | D.Madlener | 11.07.2023 | Flugrichtung ->